# EAGLE design teletype-180824 (EAGLE 7.6.0)
COMPANY: monome

## Sheet 1 of 2
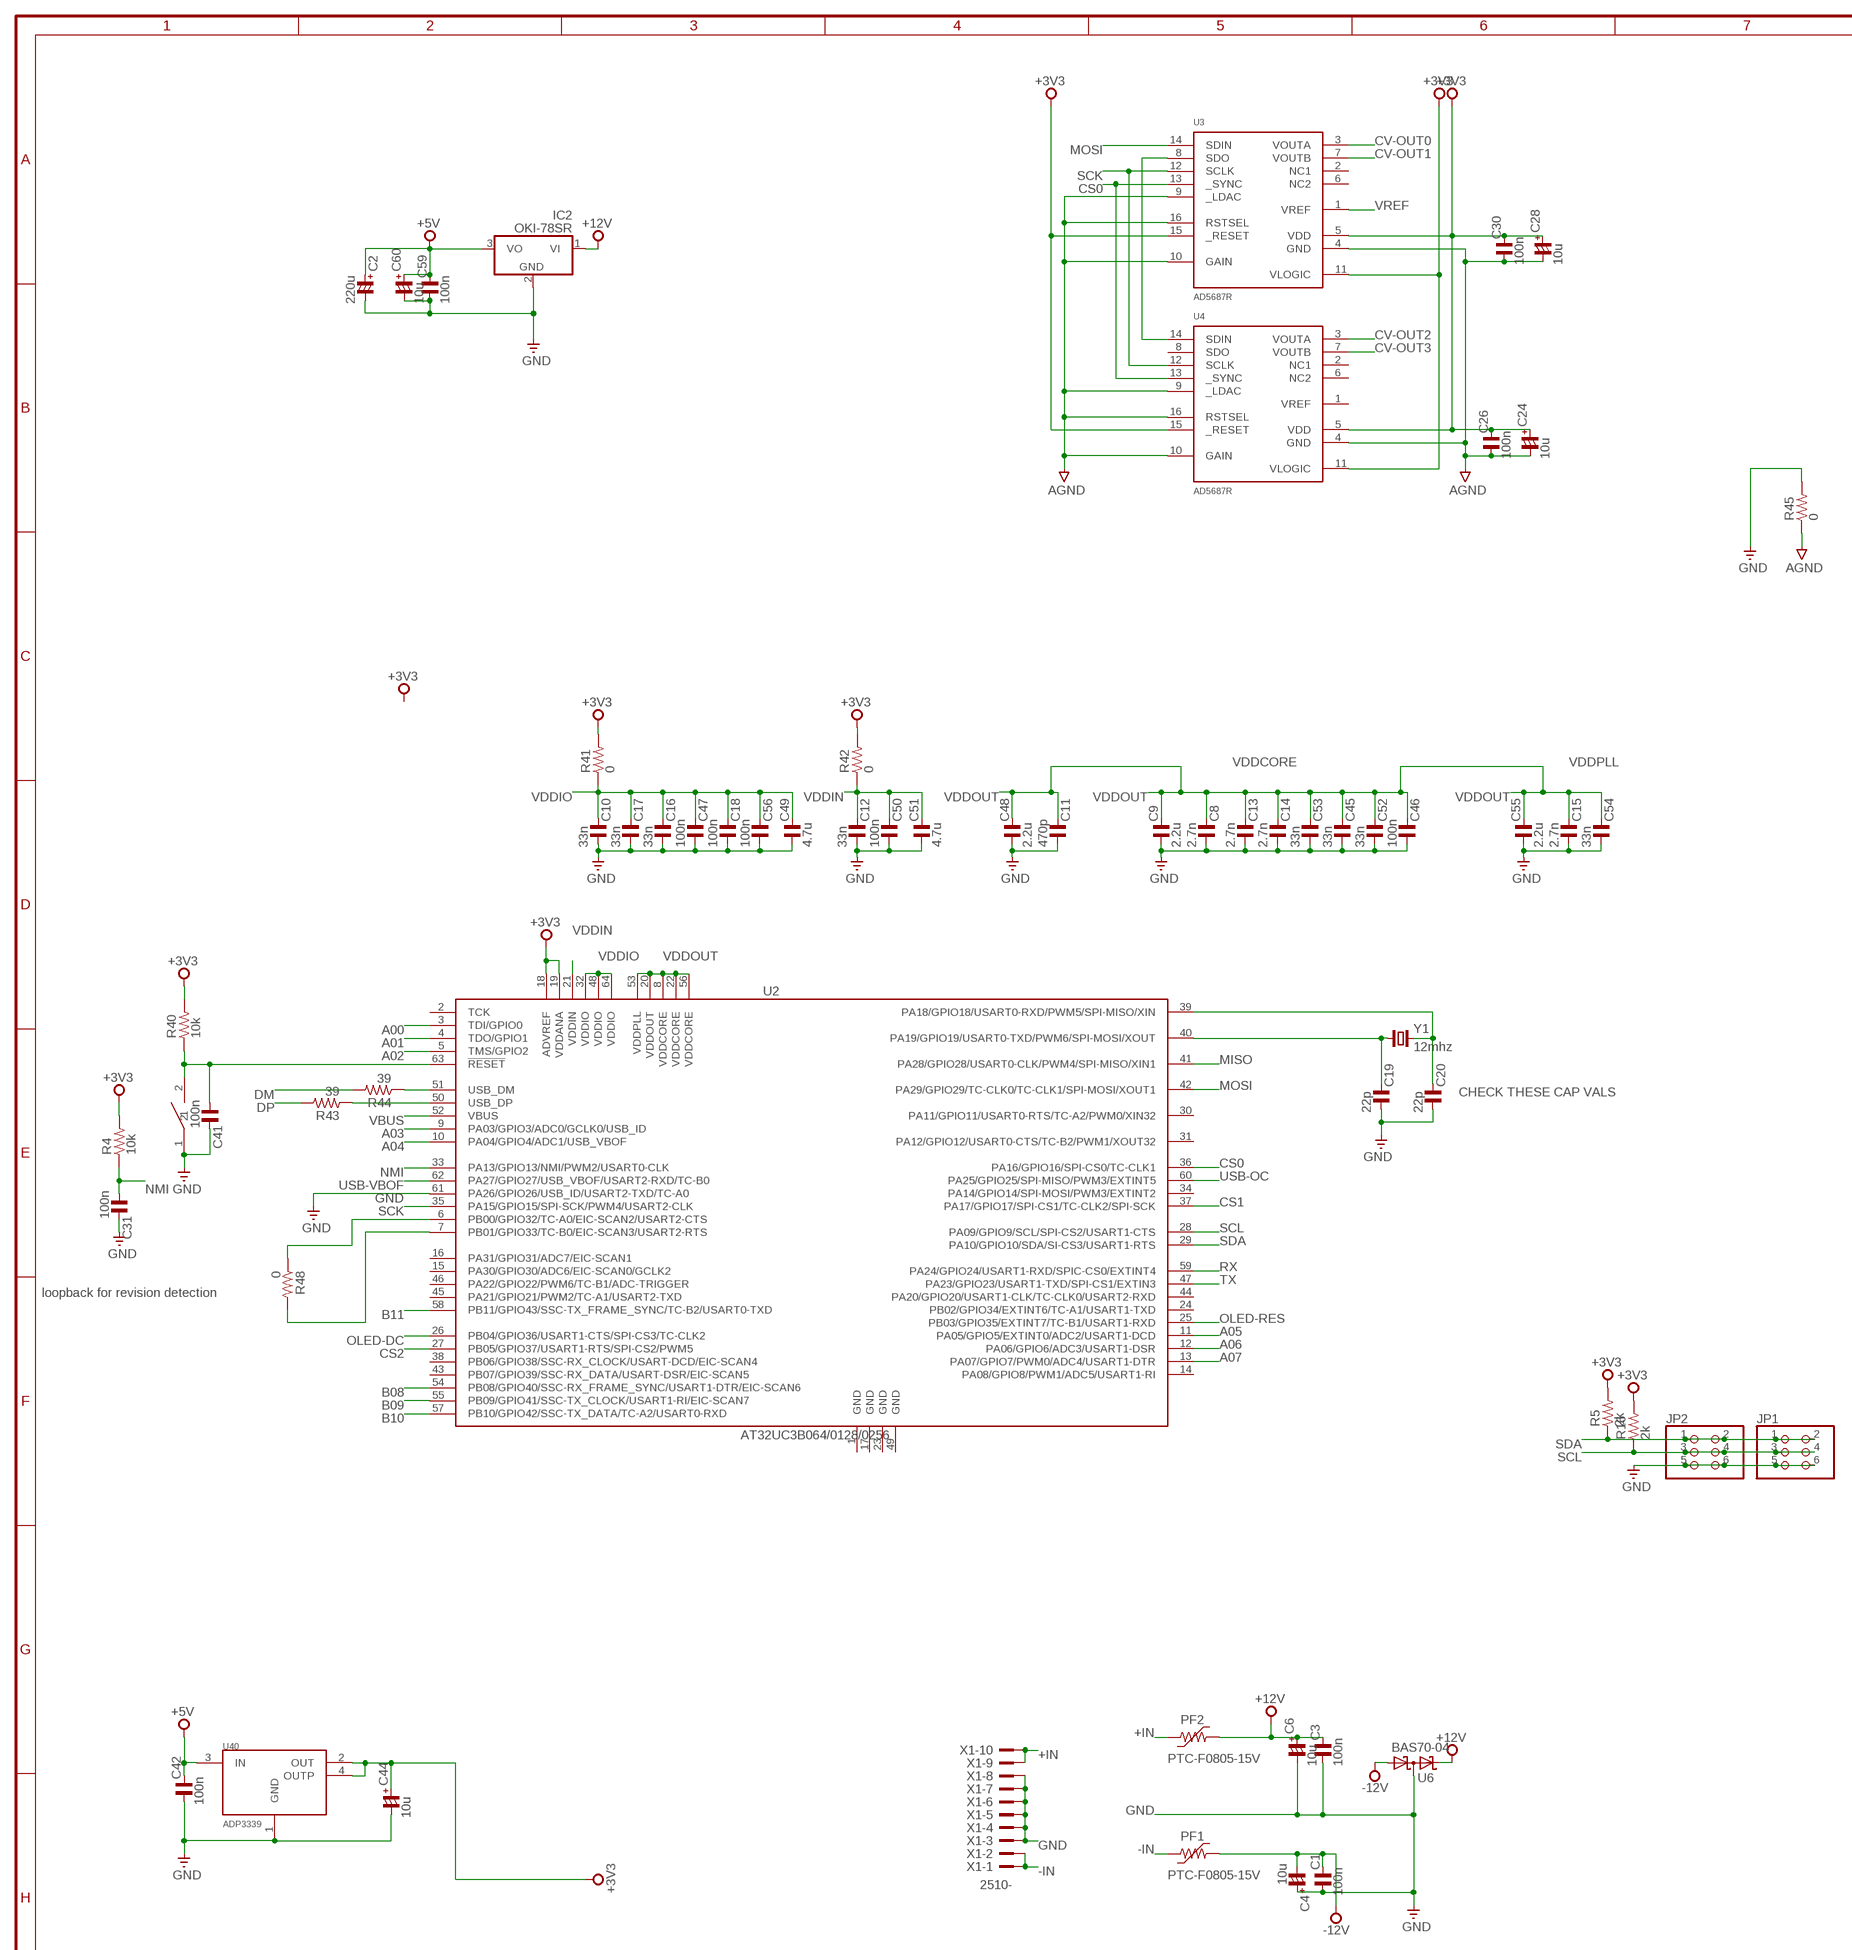
[diagram p0: schematic, sheet 1, part 1 of 2]
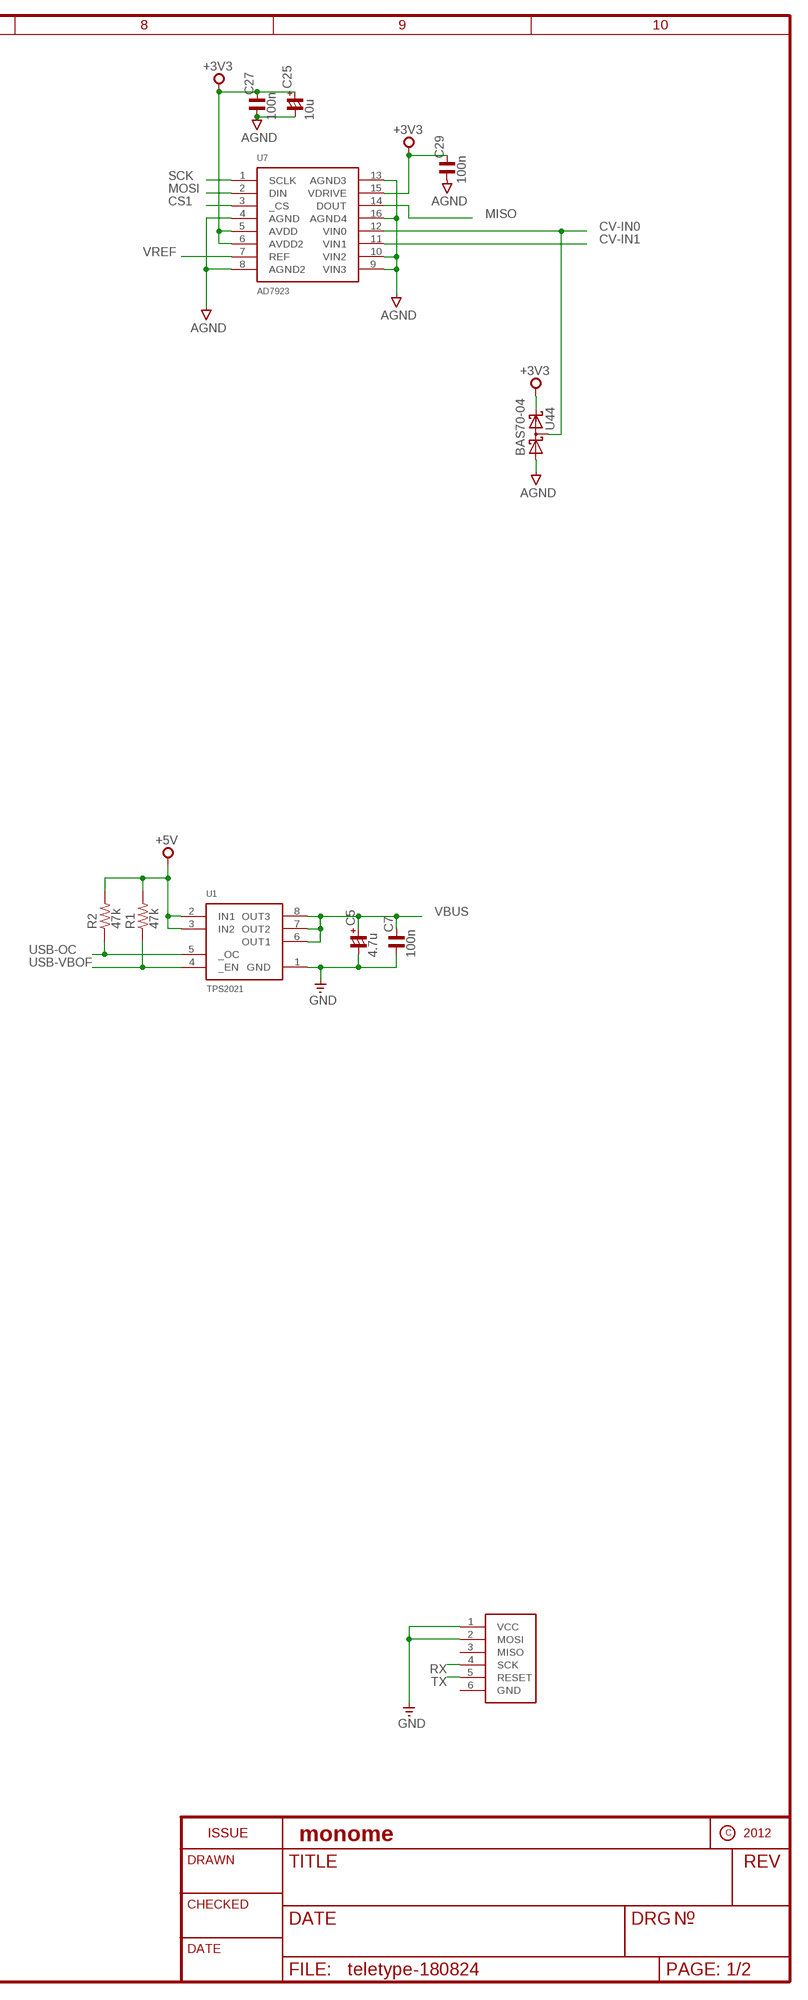
[diagram p1: schematic, sheet 1, part 2 of 2]

### Parts
C1  100n  C_0402  [C0402]
C2  220u  CP_7343-43  [C7343-43]
C3  100n  C_0402  [C0402]
C4  10u  CP_1206/T  [C1206/T]
C5  4.7u  CP_1206/T  [C1206/T]
C6  10u  CP_1206/T  [C1206/T]
C7  100n  C_0402  [C0402]
C8  2.7n  C_0402  [C0402]
C9  2.2u  C_0603  [C0603]
C10  33n  C_0402  [C0402]
C11  470p  C_0402  [C0402]
C12  33n  C_0402  [C0402]
C13  2.7n  C_0402  [C0402]
C14  2.7n  C_0402  [C0402]
C15  2.7n  C_0402  [C0402]
C16  33n  C_0402  [C0402]
C17  33n  C_0402  [C0402]
C18  100n  C_0402  [C0402]
C19  22p  C_0402  [C0402]
C20  22p  C_0402  [C0402]
C24  10u  CP_1206/T  [C1206/T]
C25  10u  CP_1206/T  [C1206/T]
C26  100n  C_0402  [C0402]
C27  100n  C_0402  [C0402]
C28  10u  CP_1206/T  [C1206/T]
C29  100n  C_0402  [C0402]
C30  100n  C_0402  [C0402]
C31  100n  C_0402  [C0402]
C41  100n  C_0402  [C0402]
C42  100n  C_0402  [C0402]
C44  10u  CP_1206/T  [C1206/T]
C45  33n  C_0402  [C0402]
C46  100n  C_0402  [C0402]
C47  100n  C_0402  [C0402]
C48  2.2u  C_0603  [C0603]
C49  4.7u  C_0603  [C0603]
C50  100n  C_0402  [C0402]
C51  4.7u  C_0603  [C0603]
C52  33n  C_0402  [C0402]
C53  33n  C_0402  [C0402]
C54  33n  C_0402  [C0402]
C55  2.2u  C_0603  [C0603]
C56  100n  C_0402  [C0402]
C59  100n  C_0402  [C0402]
C60  10u  CP_1206/T  [C1206/T]
IC2  OKI-78SR  7824TV  [TO220V]
J40  ISP-ROW  [ISP-ROW]
JP1  PINHD-2X3  [2X03]
JP2  PINHD-2X3  [2X03]
PF1  PTC-F0805-15V  PTC-F1206  [F1206]
PF2  PTC-F0805-15V  PTC-F1206  [F1206]
R1  47k  R_0402  [R0402]
R2  47k  R_0402  [R0402]
R4  10k  R_0402  [R0402]
R5  2k  R_0402  [R0402]
R16  2k  R_0402  [R0402]
R40  10k  R_0402  [R0402]
R41  0  R_0402  [R0402]
R42  0  R_0402  [R0402]
R43  39  R_0402  [R0402]
R44  39  R_0402  [R0402]
R45  0  R_0603  [R0603]
R48  0  R_0402  [R0402]
SW40  PANASONIC-EVQ  [PANASONIC-EVQ]
U1  TPS2021  TPS2020  [SO08]
U2  AT32UC3B064/0128/0256  [TQFP64-10X10]
U3  AD5687R  AD5689R  [TSSOP16]
U4  AD5687R  AD5689R  [TSSOP16]
U6  BAS70-04  [SOT23]
U7  AD7923  [TSSOP16]
U40  ADP3339  [SOT223]
U44  BAS70-04  [SOT23]
X1  2510-  [PAK100/2500-10]
Y1  12mhz  CRYTALHC49UP  [HC49UP]

### Nets
+3V3: C24.+ C25.+ C26.2 C27.2 C28.+ C29.2 C30.2 C44.+ R4.2 R5.2 R16.2 R40.2 R41.2 R42.2 U2.18(ADVREF) U2.19(VDDANA) U3.5(VDD) U3.11(VLOGIC) U3.15(_RESET) U4.5(VDD) U4.11(VLOGIC) U4.15(_RESET) U7.5(AVDD) U7.6(AVDD2) U7.15(VDRIVE) U40.2(OUT) U40.4(OUTP) U44.2(C2) ; also sheet 2
+5V: C2.+ C42.2 C59.2 C60.+ IC2.3(VO) R1.2 R2.2 U1.2(IN1) U1.3(IN2) U40.3(IN)
+12V: C3.2 C6.+ IC2.1(VI) PF2.2 U6.2(C2) ; also sheet 2
+IN: PF2.1 X1.9 X1.10
-12V: C1.2 C4.- PF1.2 U6.1(A1) ; also sheet 2
-IN: PF1.1 X1.1 X1.2
A00: U2.3(TDI/GPIO0) ; also sheet 2
A01: U2.4(TDO/GPIO1) ; also sheet 2
A02: U2.5(TMS/GPIO2) ; also sheet 2
A03: U2.9(PA03/GPIO3/ADC0/GCLK0/USB_ID) ; also sheet 2
A04: U2.10(PA04/GPIO4/ADC1/USB_VBOF) ; also sheet 2
A05: U2.11(PA05/GPIO5/EXTINT0/ADC2/USART1-DCD) ; also sheet 2
A06: U2.12(PA06/GPIO6/ADC3/USART1-DSR) ; also sheet 2
A07: U2.13(PA07/GPIO7/PWM0/ADC4/USART1-DTR) ; also sheet 2
AGND: C24.- C25.- C26.1 C27.1 C28.- C29.1 C30.1 R45.1 U3.4(GND) U3.9(_LDAC) U3.10(GAIN) U3.16(RSTSEL) U4.4(GND) U4.9(_LDAC) U4.10(GAIN) U4.16(RSTSEL) U7.4(AGND) U7.8(AGND2) U7.9(VIN3) U7.10(VIN2) U7.13(AGND3) U7.16(AGND4) U44.1(A1) ; also sheet 2
B08: U2.54(PB08/GPIO40/SSC-RX_FRAME_SYNC/USART1-DTR/EIC-SCAN6) ; also sheet 2
B09: U2.55(PB09/GPIO41/SSC-TX_CLOCK/USART1-RI/EIC-SCAN7) ; also sheet 2
B10: U2.57(PB10/GPIO42/SSC-TX_DATA/TC-A2/USART0-RXD) ; also sheet 2
B11: U2.58(PB11/GPIO43/SSC-TX_FRAME_SYNC/TC-B2/USART0-TXD) ; also sheet 2
CS0: U2.36(PA16/GPIO16/SPI-CS0/TC-CLK1) U3.13(_SYNC) U4.13(_SYNC)
CS1: U2.37(PA17/GPIO17/SPI-CS1/TC-CLK2/SPI-SCK) U7.3(_CS)
CS2: U2.27(PB05/GPIO37/USART1-RTS/SPI-CS2/PWM5) ; also sheet 2
CV-IN0: U7.12(VIN0) U44.3(C1A2) ; also sheet 2
CV-IN1: U7.11(VIN1) ; also sheet 2
CV-OUT0: U3.3(VOUTA) ; also sheet 2
CV-OUT1: U3.7(VOUTB) ; also sheet 2
CV-OUT2: U4.3(VOUTA) ; also sheet 2
CV-OUT3: U4.7(VOUTB) ; also sheet 2
DM: R44.2 ; also sheet 2
DP: R43.2 ; also sheet 2
GND: C1.1 C2.- C3.1 C4.+ C5.- C6.- C7.1 C8.1 C9.1 C10.1 C11.1 C12.1 C13.1 C14.1 C15.1 C16.1 C17.1 C18.1 C19.1 C20.1 C31.2 C41.2 C42.1 C44.- C45.1 C46.1 C47.1 C48.1 C49.1 C50.1 C51.1 C52.1 C53.1 C54.1 C55.1 C56.1 C59.1 C60.- IC2.2(GND) J40.1(VCC) J40.2(MOSI) JP1.5 JP1.6 JP2.5 JP2.6 R45.2 SW40.1 U1.1(GND) U2.61(PA26/GPIO26/USB_ID/USART2-TXD/TC-A0) U6.3(C1A2) U40.1(GND) X1.3 X1.4 X1.5 X1.6 X1.7 X1.8 ; also sheet 2
MISO: U2.41(PA28/GPIO28/USART0-CLK/PWM4/SPI-MISO/XIN1) U7.14(DOUT)
MOSI: U2.42(PA29/GPIO29/TC-CLK0/TC-CLK1/SPI-MOSI/XOUT1) U3.14(SDIN) U7.2(DIN) ; also sheet 2
N$1: R44.1 U2.51(USB_DM)
N$2: R43.1 U2.50(USB_DP)
N$4: U3.8(SDO) U4.14(SDIN)
N$14: C20.2 U2.39(PA18/GPIO18/USART0-RXD/PWM5/SPI-MISO/XIN) Y1.2
N$17: R48.1 U2.6(PB00/GPIO32/TC-A0/EIC-SCAN2/USART2-CTS)
N$18: R48.2 U2.7(PB01/GPIO33/TC-B0/EIC-SCAN3/USART2-RTS)
N$109: C19.2 U2.40(PA19/GPIO19/USART0-TXD/PWM6/SPI-MOSI/XOUT) Y1.1
NMI: C31.1 R4.1 U2.33(PA13/GPIO13/NMI/PWM2/USART0-CLK) ; also sheet 2
OLED-DC: U2.26(PB04/GPIO36/USART1-CTS/SPI-CS3/TC-CLK2) ; also sheet 2
OLED-RES: U2.25(PB03/GPIO35/EXTINT7/TC-B1/USART1-RXD) ; also sheet 2
RESET: C41.1 R40.1 SW40.2 U2.63(!RESET)
RX: J40.4(SCK) U2.59(PA24/GPIO24/USART1-RXD/SPIC-CS0/EXTINT4)
SCK: U2.35(PA15/GPIO15/SPI-SCK/PWM4/USART2-CLK) U3.12(SCLK) U4.12(SCLK) U7.1(SCLK) ; also sheet 2
SCL: JP1.3 JP1.4 JP2.3 JP2.4 R16.1 U2.28(PA09/GPIO9/SCL/SPI-CS2/USART1-CTS)
SDA: JP1.1 JP1.2 JP2.1 JP2.2 R5.1 U2.29(PA10/GPIO10/SDA/SI-CS3/USART1-RTS)
TX: J40.5(RESET) U2.47(PA23/GPIO23/USART1-TXD/SPI-CS1/EXTIN3)
USB-OC: R2.1 U1.5(_OC) U2.60(PA25/GPIO25/SPI-MISO/PWM3/EXTINT5)
USB-VBOF: R1.1 U1.4(_EN) U2.62(PA27/GPIO27/USB_VBOF/USART2-RXD/TC-B0)
VBUS: C5.+ C7.2 U1.6(OUT1) U1.7(OUT2) U1.8(OUT3) U2.52(VBUS) ; also sheet 2
VDDIN: C12.2 C50.2 C51.2 R42.1 U2.21(VDDIN)
VDDIO: C10.2 C16.2 C17.2 C18.2 C47.2 C49.2 C56.2 R41.1 U2.32(VDDIO) U2.48(VDDIO) U2.64(VDDIO)
VDDOUT: C8.2 C9.2 C11.2 C13.2 C14.2 C15.2 C45.2 C46.2 C48.2 C52.2 C53.2 C54.2 C55.2 U2.8(VDDCORE) U2.20(VDDOUT) U2.22(VDDCORE) U2.53(VDDPLL) U2.56(VDDCORE)
VREF: U3.1(VREF) U7.7(REF)
Unconnected: J40.3(MISO) J40.6(GND) U2.2(TCK) U2.14(PA08/GPIO8/PWM1/ADC5/USART1-RI) U2.15(PA30/GPIO30/ADC6/EIC-SCAN0/GCLK2) U2.16(PA31/GPIO31/ADC7/EIC-SCAN1) U2.24(PB02/GPIO34/EXTINT6/TC-A1/USART1-TXD) U2.30(PA11/GPIO11/USART0-RTS/TC-A2/PWM0/XIN32) U2.31(PA12/GPIO12/USART0-CTS/TC-B2/PWM1/XOUT32) U2.34(PA14/GPIO14/SPI-MOSI/PWM3/EXTINT2) U2.38(PB06/GPIO38/SSC-RX_CLOCK/USART-DCD/EIC-SCAN4) U2.43(PB07/GPIO39/SSC-RX_DATA/USART-DSR/EIC-SCAN5) U2.44(PA20/GPIO20/USART1-CLK/TC-CLK0/USART2-RXD) U2.45(PA21/GPIO21/PWM2/TC-A1/USART2-TXD) U2.46(PA22/GPIO22/PWM6/TC-B1/ADC-TRIGGER) U3.2(NC1) U3.6(NC2) U4.1(VREF) U4.2(NC1) U4.6(NC2) U4.8(SDO)

### Notes on the sheet
- VDDCORE | VDDPLL
- CHECK THESE CAP VALS
- loopback for revision detection

## Sheet 2 of 2
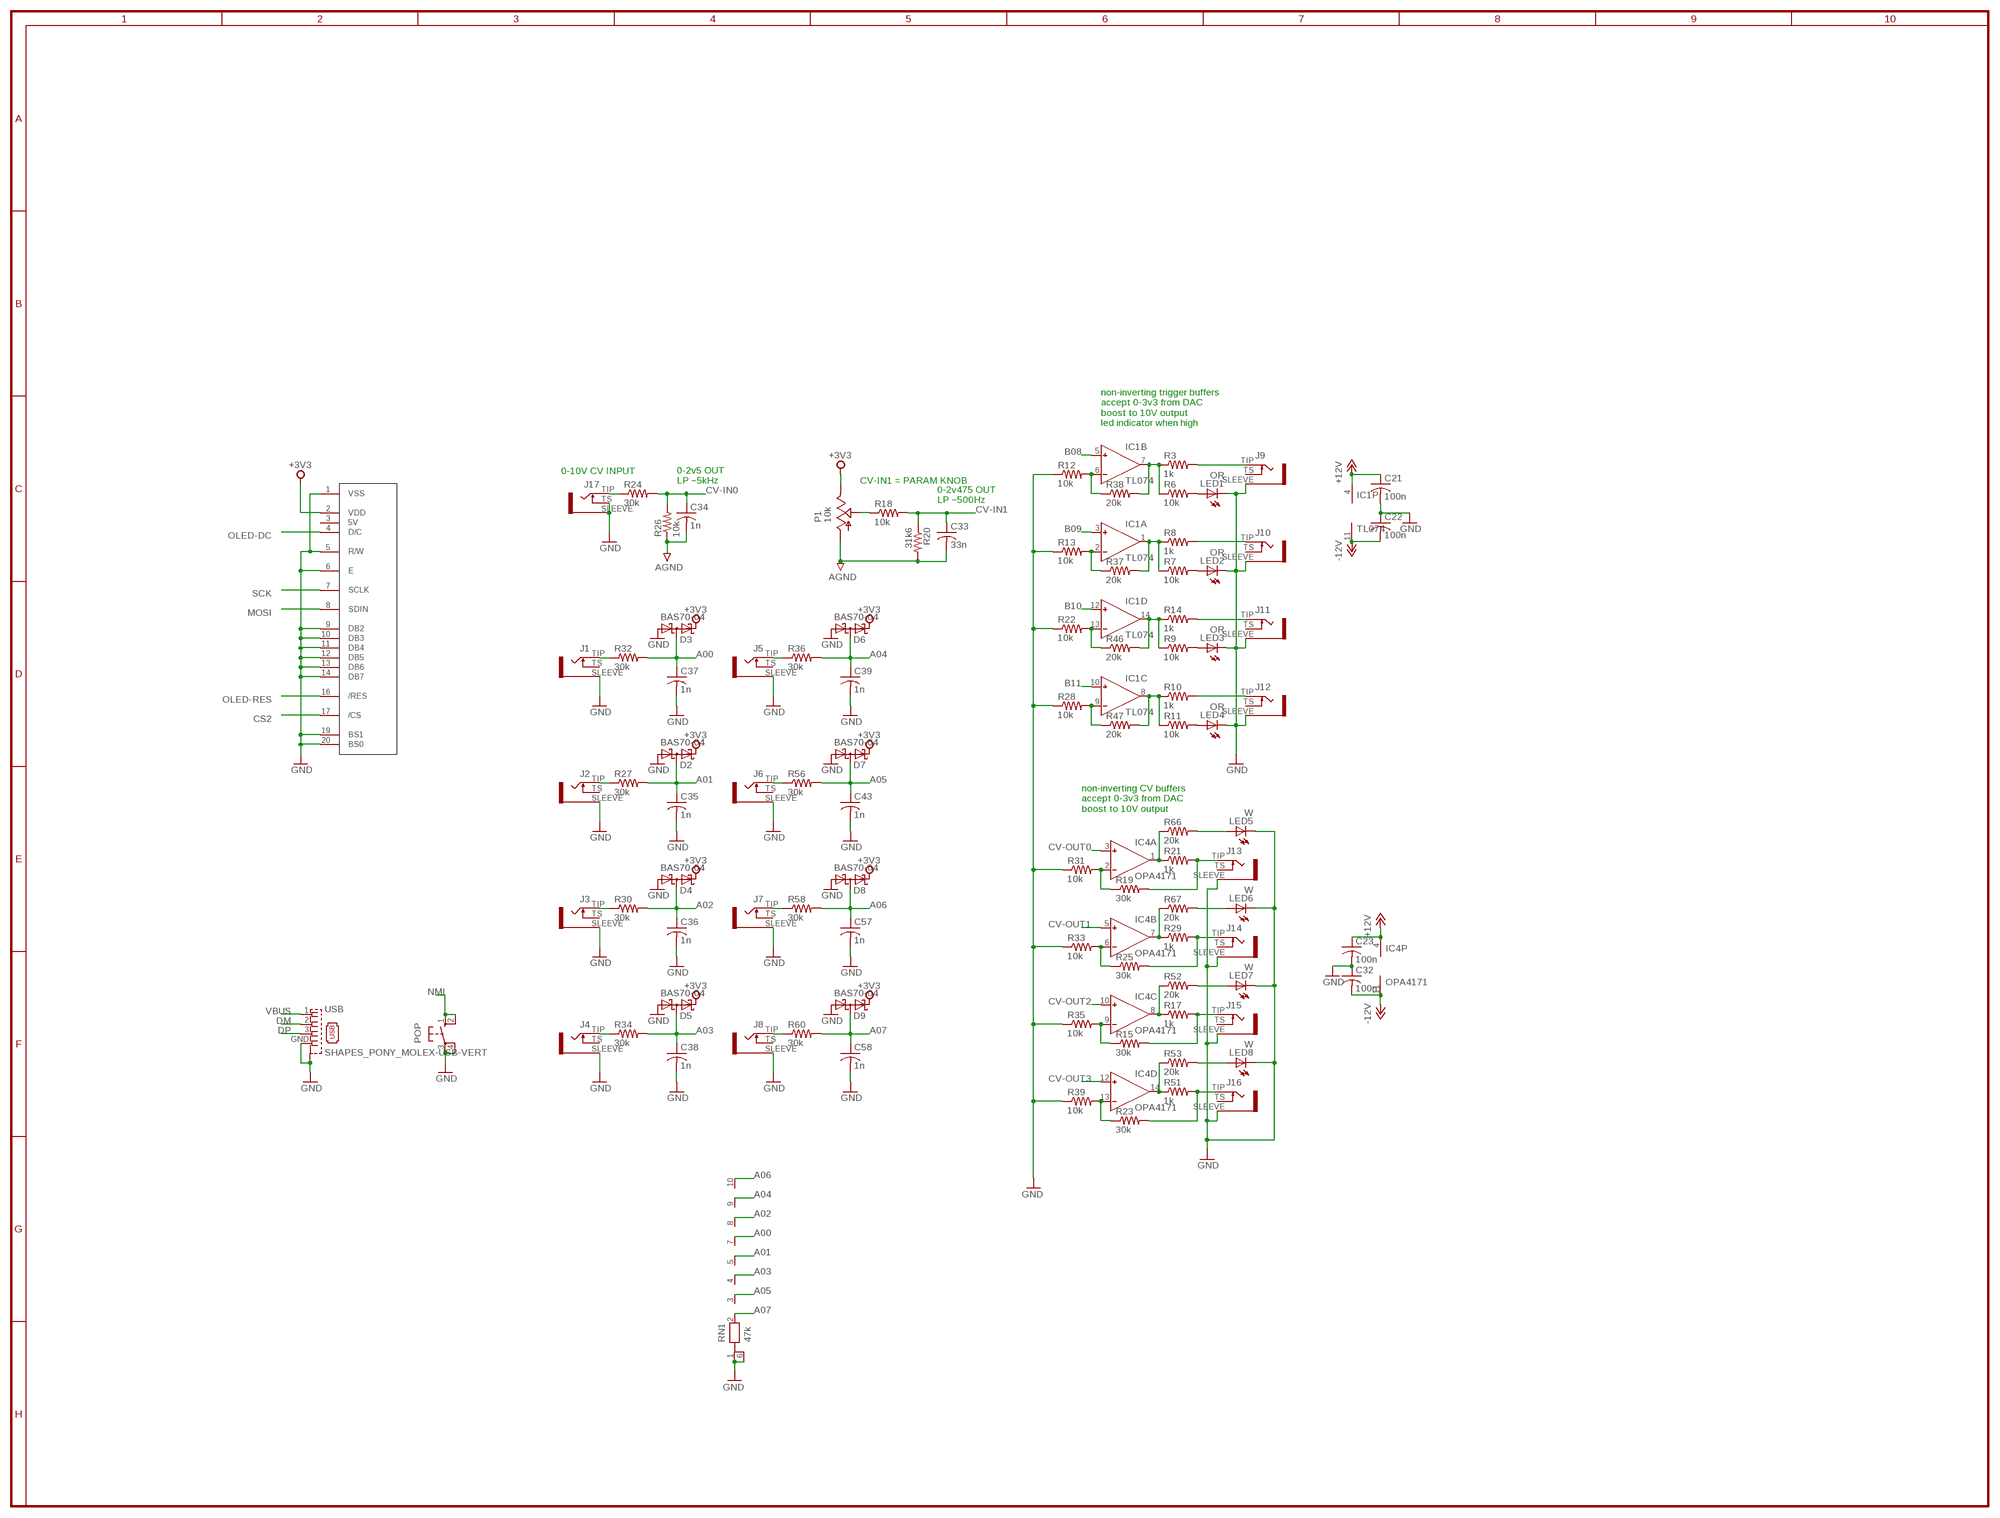
[diagram p2: schematic, sheet 2]

### Parts
C21  100n  C-USC0402  [C0402]
C22  100n  C-USC0402  [C0402]
C23  100n  C-USC0402  [C0402]
C32  100n  C-USC0402  [C0402]
C33  33n  C-USC0402  [C0402]
C34  1n  C-USC0402  [C0402]
C35  1n  C-USC0402  [C0402]
C36  1n  C-USC0402  [C0402]
C37  1n  C-USC0402  [C0402]
C38  1n  C-USC0402  [C0402]
C39  1n  C-USC0402  [C0402]
C43  1n  C-USC0402  [C0402]
C57  1n  C-USC0402  [C0402]
C58  1n  C-USC0402  [C0402]
D2  BAS70-04  [SOT23]
D3  BAS70-04  [SOT23]
D4  BAS70-04  [SOT23]
D5  BAS70-04  [SOT23]
D6  BAS70-04  [SOT23]
D7  BAS70-04  [SOT23]
D8  BAS70-04  [SOT23]
D9  BAS70-04  [SOT23]
IC1  TL074  AD8644R  [SO14]
IC4  OPA4171  AD8644R  [SO14]
J1  WQP-PJ301M-12_JACK  [WQP-PJ301M-12_JACK]
J2  WQP-PJ301M-12_JACK  [WQP-PJ301M-12_JACK]
J3  WQP-PJ301M-12_JACK  [WQP-PJ301M-12_JACK]
J4  WQP-PJ301M-12_JACK  [WQP-PJ301M-12_JACK]
J5  WQP-PJ301M-12_JACK  [WQP-PJ301M-12_JACK]
J6  WQP-PJ301M-12_JACK  [WQP-PJ301M-12_JACK]
J7  WQP-PJ301M-12_JACK  [WQP-PJ301M-12_JACK]
J8  WQP-PJ301M-12_JACK  [WQP-PJ301M-12_JACK]
J9  WQP-PJ301M-12_JACK  [WQP-PJ301M-12_JACK]
J10  WQP-PJ301M-12_JACK  [WQP-PJ301M-12_JACK]
J11  WQP-PJ301M-12_JACK  [WQP-PJ301M-12_JACK]
J12  WQP-PJ301M-12_JACK  [WQP-PJ301M-12_JACK]
J13  WQP-PJ301M-12_JACK  [WQP-PJ301M-12_JACK]
J14  WQP-PJ301M-12_JACK  [WQP-PJ301M-12_JACK]
J15  WQP-PJ301M-12_JACK  [WQP-PJ301M-12_JACK]
J16  WQP-PJ301M-12_JACK  [WQP-PJ301M-12_JACK]
J17  WQP-PJ301M-12_JACK  [WQP-PJ301M-12_JACK]
LED1  OR  LEDCHIP-LED0805  [CHIP-LED0805]
LED2  OR  LEDCHIP-LED0805  [CHIP-LED0805]
LED3  OR  LEDCHIP-LED0805  [CHIP-LED0805]
LED4  OR  LEDCHIP-LED0805  [CHIP-LED0805]
LED5  W  LEDCHIP-LED0805  [CHIP-LED0805]
LED6  W  LEDCHIP-LED0805  [CHIP-LED0805]
LED7  W  LEDCHIP-LED0805  [CHIP-LED0805]
LED8  W  LEDCHIP-LED0805  [CHIP-LED0805]
P1  10k  SHAPES_POT-ALPS_POT_USVERTICAL_PS  [SHAPES_POT-ALPS_ALPS_POT_VERTICAL_PS]
POP  SWITCH-OMRON_10-XX  [SWITCH-OMRON_B3F-10XX]
R3  1k  R-US_R0402  [R0402]
R6  10k  R-US_R0402  [R0402]
R7  10k  R-US_R0402  [R0402]
R8  1k  R-US_R0402  [R0402]
R9  10k  R-US_R0402  [R0402]
R10  1k  R-US_R0402  [R0402]
R11  10k  R-US_R0402  [R0402]
R12  10k  R-US_R0402  [R0402]
R13  10k  R-US_R0402  [R0402]
R14  1k  R-US_R0402  [R0402]
R15  30k  R-US_R0402  [R0402]
R17  1k  R-US_R0402  [R0402]
R18  10k  R-US_R0402  [R0402]
R19  30k  R-US_R0402  [R0402]
R20  31k6  R-US_R0402  [R0402]
R21  1k  R-US_R0402  [R0402]
R22  10k  R-US_R0402  [R0402]
R23  30k  R-US_R0402  [R0402]
R24  30k  R-US_R0402  [R0402]
R25  30k  R-US_R0402  [R0402]
R26  10k  R-US_R0402  [R0402]
R27  30k  R-US_R0402  [R0402]
R28  10k  R-US_R0402  [R0402]
R29  1k  R-US_R0402  [R0402]
R30  30k  R-US_R0402  [R0402]
R31  10k  R-US_R0402  [R0402]
R32  30k  R-US_R0402  [R0402]
R33  10k  R-US_R0402  [R0402]
R34  30k  R-US_R0402  [R0402]
R35  10k  R-US_R0402  [R0402]
R36  30k  R-US_R0402  [R0402]
R37  20k  R-US_R0402  [R0402]
R38  20k  R-US_R0402  [R0402]
R39  10k  R-US_R0402  [R0402]
R46  20k  R-US_R0402  [R0402]
R47  20k  R-US_R0402  [R0402]
R51  1k  R-US_R0402  [R0402]
R52  20k  R-US_R0402  [R0402]
R53  20k  R-US_R0402  [R0402]
R56  30k  R-US_R0402  [R0402]
R58  30k  R-US_R0402  [R0402]
R60  30k  R-US_R0402  [R0402]
R66  20k  R-US_R0402  [R0402]
R67  20k  R-US_R0402  [R0402]
RN1  47k  RESNET08  [MNR35]
U$1  OLED128X64  [OLED-ALEPH]
USB  SHAPES_PONY_MOLEX-USB-VERT  [SHAPES_PONY_MOLEX-USB]

### Nets
+3V3: D2.2(C2) D3.2(C2) D4.2(C2) D5.2(C2) D6.2(C2) D7.2(C2) D8.2(C2) D9.2(C2) P1.P$1(E) U$1.2(VDD) ; also sheet 1
+12V: C21.1 C23.1 IC1.4(P:V+) IC4.4(P:V+) ; also sheet 1
-12V: C22.2 C32.2 IC1.11(P:V-) IC4.11(P:V-) ; also sheet 1
A00: C37.1 D3.3(C1A2) R32.2 RN1.7 ; also sheet 1
A01: C35.1 D2.3(C1A2) R27.2 RN1.5 ; also sheet 1
A02: C36.1 D4.3(C1A2) R30.2 RN1.8 ; also sheet 1
A03: C38.1 D5.3(C1A2) R34.2 RN1.4 ; also sheet 1
A04: C39.1 D6.3(C1A2) R36.2 RN1.9 ; also sheet 1
A05: C43.1 D7.3(C1A2) R56.2 RN1.3 ; also sheet 1
A06: C57.1 D8.3(C1A2) R58.2 RN1.10 ; also sheet 1
A07: C58.1 D9.3(C1A2) R60.2 RN1.2 ; also sheet 1
AGND: C33.2 C34.2 P1.P$3(A) R20.2 R26.1 ; also sheet 1
B08: IC1.5(B:IN+) ; also sheet 1
B09: IC1.3(A:IN+) ; also sheet 1
B10: IC1.12(D:IN+) ; also sheet 1
B11: IC1.10(C:IN+) ; also sheet 1
CS2: U$1.17(/CS) ; also sheet 1
CV-IN0: C34.1 R24.2 R26.2 ; also sheet 1
CV-IN1: C33.1 R18.2 R20.1 ; also sheet 1
CV-OUT0: IC4.3(A:IN+) ; also sheet 1
CV-OUT1: IC4.5(B:IN+) ; also sheet 1
CV-OUT2: IC4.10(C:IN+) ; also sheet 1
CV-OUT3: IC4.12(D:IN+) ; also sheet 1
DM: USB.2 ; also sheet 1
DP: USB.3 ; also sheet 1
GND: C21.2 C22.1 C23.2 C32.1 C35.2 C36.2 C37.2 C38.2 C39.2 C43.2 C57.2 C58.2 D2.1(A1) D3.1(A1) D4.1(A1) D5.1(A1) D6.1(A1) D7.1(A1) D8.1(A1) D9.1(A1) J1.SLEEVE J2.SLEEVE J3.SLEEVE J4.SLEEVE J5.SLEEVE J6.SLEEVE J7.SLEEVE J8.SLEEVE J9.SLEEVE J10.SLEEVE J11.SLEEVE J12.SLEEVE J13.SLEEVE J14.SLEEVE J15.SLEEVE J16.SLEEVE J17.SLEEVE J17.TS LED1.C LED2.C LED3.C LED4.C LED5.C LED6.C LED7.C LED8.C POP.3(P) POP.4(P1) R12.1 R13.1 R22.1 R28.1 R31.1 R33.1 R35.1 R39.1 RN1.1 RN1.6 U$1.1(VSS) U$1.5(R/W) U$1.6(E) U$1.9(DB2) U$1.10(DB3) U$1.11(DB4) U$1.12(DB5) U$1.13(DB6) U$1.14(DB7) U$1.19(BS1) U$1.20(BS0) USB.GND USB.M1(S1) USB.M2(S1) USB.M4(S1) ; also sheet 1
MOSI: U$1.8(SDIN) ; also sheet 1
N$3: IC1.7(B:OUT) R3.1 R6.1 R38.2
N$5: IC1.1(A:OUT) R7.1 R8.1 R37.2
N$6: IC1.14(D:OUT) R9.1 R14.1 R46.2
N$7: IC1.8(C:OUT) R10.1 R11.1 R47.2
N$8: J9.TIP R3.2
N$9: J10.TIP R8.2
N$10: J11.TIP R14.2
N$11: J12.TIP R10.2
N$12: P1.P$2(S) R18.1
N$13: IC4.1(A:OUT) R21.1 R66.1
N$15: IC4.7(B:OUT) R29.1 R67.1
N$16: LED5.A R66.2
N$21: J15.TIP R15.2 R17.2
N$22: J16.TIP R23.2 R51.2
N$23: IC4.8(C:OUT) R17.1 R52.1
N$24: LED6.A R67.2
N$28: IC4.14(D:OUT) R51.1 R53.1
N$29: LED7.A R52.2
N$30: LED8.A R53.2
N$32: J13.TIP R19.2 R21.2
N$33: J17.TIP R24.1
N$34: J14.TIP R25.2 R29.2
N$35: J2.TIP R27.1
N$36: J3.TIP R30.1
N$37: J4.TIP R34.1
N$38: J1.TIP R32.1
N$39: J5.TIP R36.1
N$40: J6.TIP R56.1
N$43: J7.TIP R58.1
N$44: J8.TIP R60.1
N$67: LED1.A R6.2
N$68: LED2.A R7.2
N$70: LED3.A R9.2
N$71: LED4.A R11.2
NMI: POP.1(S) POP.2(S1) ; also sheet 1
OLED-DC: U$1.4(D/C) ; also sheet 1
OLED-RES: U$1.16(/RES) ; also sheet 1
RG1: IC1.6(B:IN-) R12.2 R38.1
RG2: IC1.2(A:IN-) R13.2 R37.1
RG3: IC1.13(D:IN-) R22.2 R46.1
RG4: IC1.9(C:IN-) R28.2 R47.1
RG5: IC4.2(A:IN-) R19.1 R31.2
RG6: IC4.6(B:IN-) R25.1 R33.2
RG7: IC4.9(C:IN-) R15.1 R35.2
RG8: IC4.13(D:IN-) R23.1 R39.2
SCK: U$1.7(SCLK) ; also sheet 1
VBUS: USB.1 ; also sheet 1
Unconnected: J1.TS J2.TS J3.TS J4.TS J5.TS J6.TS J7.TS J8.TS J9.TS J10.TS J11.TS J12.TS J13.TS J14.TS J15.TS J16.TS U$1.3(5V)

### Notes on the sheet
- non-inverting trigger buffers
  accept 0-3v3 from DAC
  boost to 10V output
  led indicator when high
- 0-10V CV INPUT
- 0-2v5 OUT
  LP ~5kHz
- CV-IN1 = PARAM KNOB
- 0-2v475 OUT
  LP ~500Hz
- non-inverting CV buffers
  accept 0-3v3 from DAC
  boost to 10V output

## Power pins joined to a net without a drawn wire
GND: U2.1(GND) U2.17(GND) U2.23(GND) U2.49(GND)

## Library data of the parts
C1 C3 C7-C20 C26 C27 C29-C31 C41 C42 C45-C56 C59 = rc-master-smd:C_: NON-POLARIZED CAP
C2 C4-C6 C24 C25 C28 C44 C60 = rc-master-smd:CP_: POLARIZED CAP
C21-C23 C32-C39 C43 C57 C58 = rcl:C-US: CAPACITOR, American symbol
D2-D9 U6 U44 = diode:BAS70-04: Silicon Schottky Diodes General-purpose diode for high-speed switching
IC1 IC4 = analog-devices:AD8644: Single and Quad 18 V Operational Amplifiers Source: http://www.analog.com/static/imported-files/data_sheets/AD8614_8644.pdf; MF: ALTERA CORPORATION; MPN: AD8644ARZ; OC_FARNELL: 1438873; OC_NEWARK: 59K7037
IC2 = linear:78*: Positive VOLTAGE REGULATOR Source: http://cache.national.com/ds/LM/LM78L05.pdf http://www.fairchildsemi.com/ds/LM/LM7805.pdf
J1-J17 = thonkiconn:WQP-PJ301M-12_JACK
J40 = monome-inc:ISP-ROW
JP1 JP2 = pinhead:PINHD-2X3: PIN HEADER
LED1-LED8 = led:LED: LED OSRAM: - CHIPLED LG R971, LG N971, LY N971, LG Q971, LY Q971, LO R971, LY R971 LH N974, LH R974 LS Q976, LO Q976, LY Q976 LO Q996 - Hyper CHIPLED LW Q18S LB Q993, LB Q99A, LB R99A - SideLED LS A670, LO A670, LY A670, LG A670, LP A670 LB A673, LV A673, LT A673, LW A673 LH A674 LY A675 LS A676, LA A676, LO A676, LY A676, LW A676 LS A679, LY A679, LG A679 - Hyper Micro SIDELED® LS Y876, LA Y876, LO Y876, LY Y876 LT Y87S - SmartLED LW L88C, LW L88S LB L89C, LB L89S, LG L890 LS L89K, LO L89K, LY L89K LS L896, LA L896, LO L896, LY L896 - TOPLED LS T670, LO T670, LY T670, LG T670, LP T670 LSG T670, LSP T670, LSY T670, LOP T670, LYG T670 LG T671, LOG T671, LSG T671 LB T673, LV T673, LT T673, LW T673 LH T674 LS T676, LA T676, LO T676, LY T676, LB T676, LH T676, LSB T676, LW T676 LB T67C, LV T67C, LT T67C, LS T67K, LO T67K, LY T67K, LW E67C LS E67B, LA E67B, LO E67B, LY E67B, LB E67C, LV E67C, LT E67C LW T67C LS T679, LY T679, LG T679 LS T770, LO T770, LY T770, LG T770, LP T770 LB T773, LV T773, LT T773, LW T773 LH T774 LS E675, LA E675, LY E675, LS T675 LS T776, LA T776, LO T776, LY T776, LB T776 LHGB T686 LT T68C, LB T68C - Hyper Mini TOPLED® LB M676 - Mini TOPLED Santana® LG M470 LS M47K, LO M47K, LY M47K Source: http://www.osram.convergy.de LUXEON: - LUMILED® LXK2-PW12-R00, LXK2-PW12-S00, LXK2-PW14-U00, LXK2-PW14-V00 LXK2-PM12-R00, LXK2-PM12-S00, LXK2-PM14-U00 LXK2-PE12-Q00, LXK2-PE12-R00, LXK2-PE12-S00, LXK2-PE14-T00, LXK2-PE14-U00 LXK2-PB12-K00, LXK2-PB12-L00, LXK2-PB12-M00, LXK2-PB14-N00, LXK2-PB14-P00, LXK2-PB14-Q00 LXK2-PR12-L00, LXK2-PR12-M00, LXK2-PR14-Q00, LXK2-PR14-R00 LXK2-PD12-Q00, LXK2-PD12-R00, LXK2-PD12-S00 LXK2-PH12-R00, LXK2-PH12-S00 LXK2-PL12-P00, LXK2-PL12-Q00, LXK2-PL12-R00 Source: www.luxeon.com KINGBRIGHT: KA-3528ASYC Source: www.kingbright.com
P1 = monome_modular:SHAPES_POT-ALPS_POT_US
PF1 PF2 = polyswitch:PTC-: POLYSWITCH Polyswitch Resetable Fuses
POP = monome_modular:SWITCH-OMRON_10-XX: OMRON SWITCH; MPN: B3F-1000; OC_FARNELL: 176432; OC_NEWARK: 36M3542
R1 R2 R4 R5 R16 R40-R45 R48 = rc-master-smd:R_: RESISTOR
R3 R6-R15 R17-R39 R46 R47 R51-R53 R56 R58 R60 R66 R67 = rcl:R-US_: RESISTOR, American symbol
RN1 = field:RESNET08
SW40 = monome-inc:PANASONIC-EVQ
U1 = monome-inc:TPS2020
U2 = atmel-avr32-michel-rev1:AT32UC3B064/0128/0256: AT32UC3B0128/0256/0512
U3 U4 = monome-inc:AD5689R
U7 = monome-inc:AD7923: ADC quad 12 bit
U40 = monome-inc:ADP3339
U$1 = monome_modular:OLED128X64
USB = monome_modular:SHAPES_PONY_MOLEX-USB-VERT
X1 = con-3m:2510-: 3M (TM) Pak 100 4-Wall Header Source: 3M; MF: 3M; MPN: 2510-6002UB; OC_FARNELL: 9838244; OC_NEWARK: 46F4725
Y1 = crystal:CRYTAL: CRYSTAL

## Board
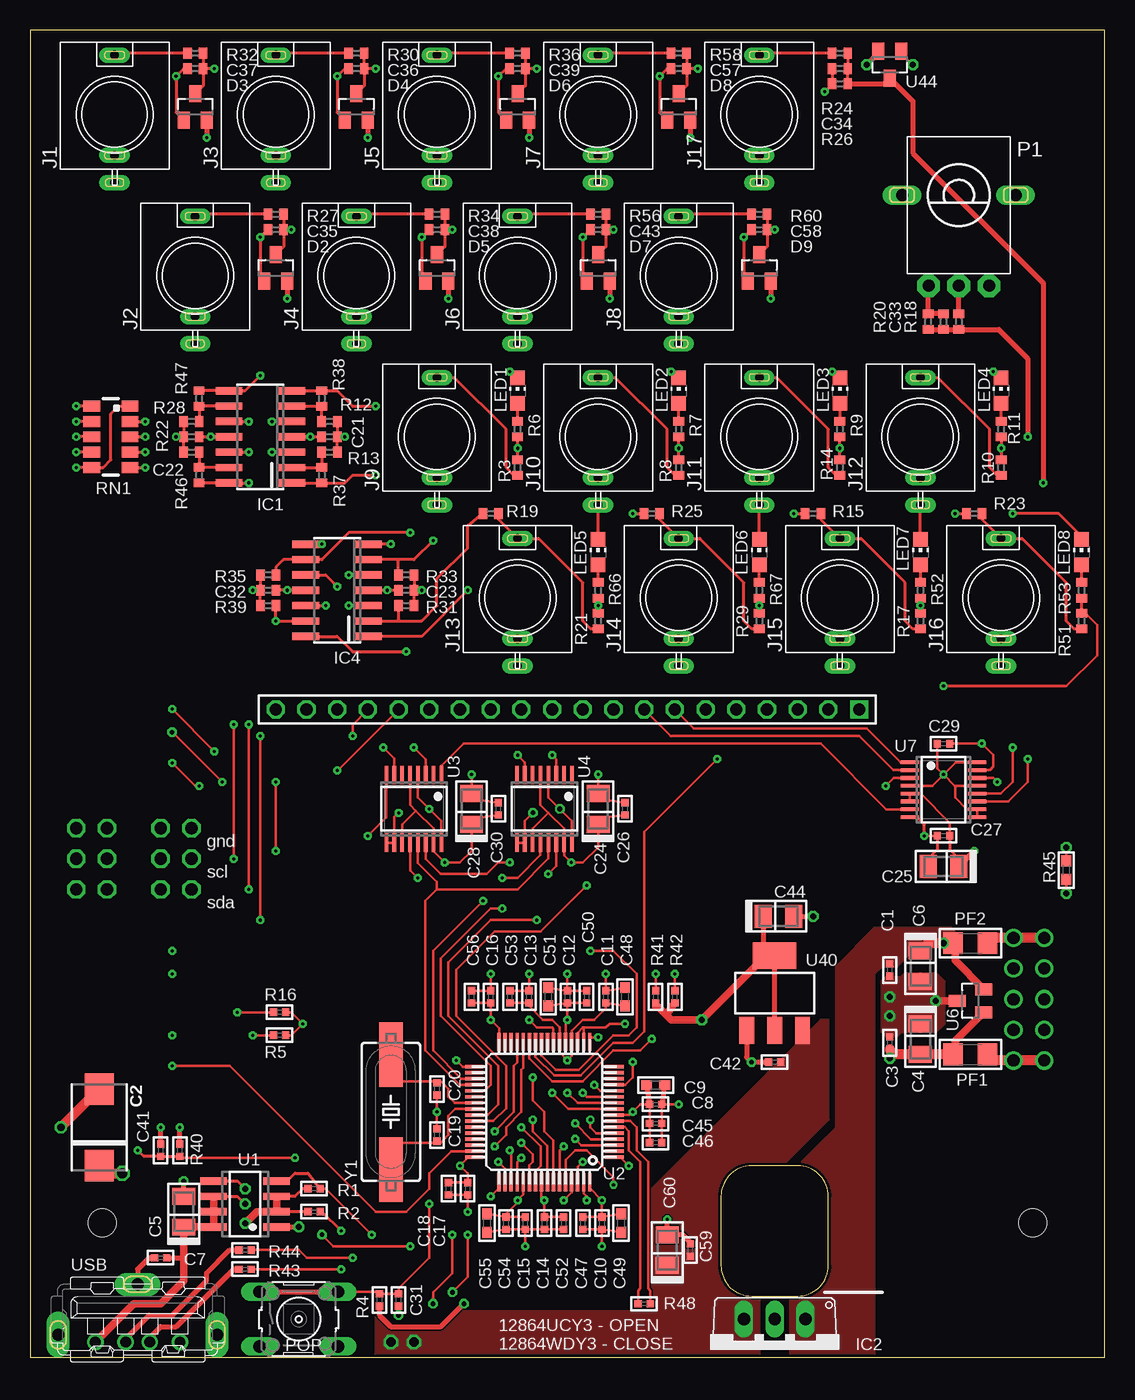
[diagram p3: board, top side]
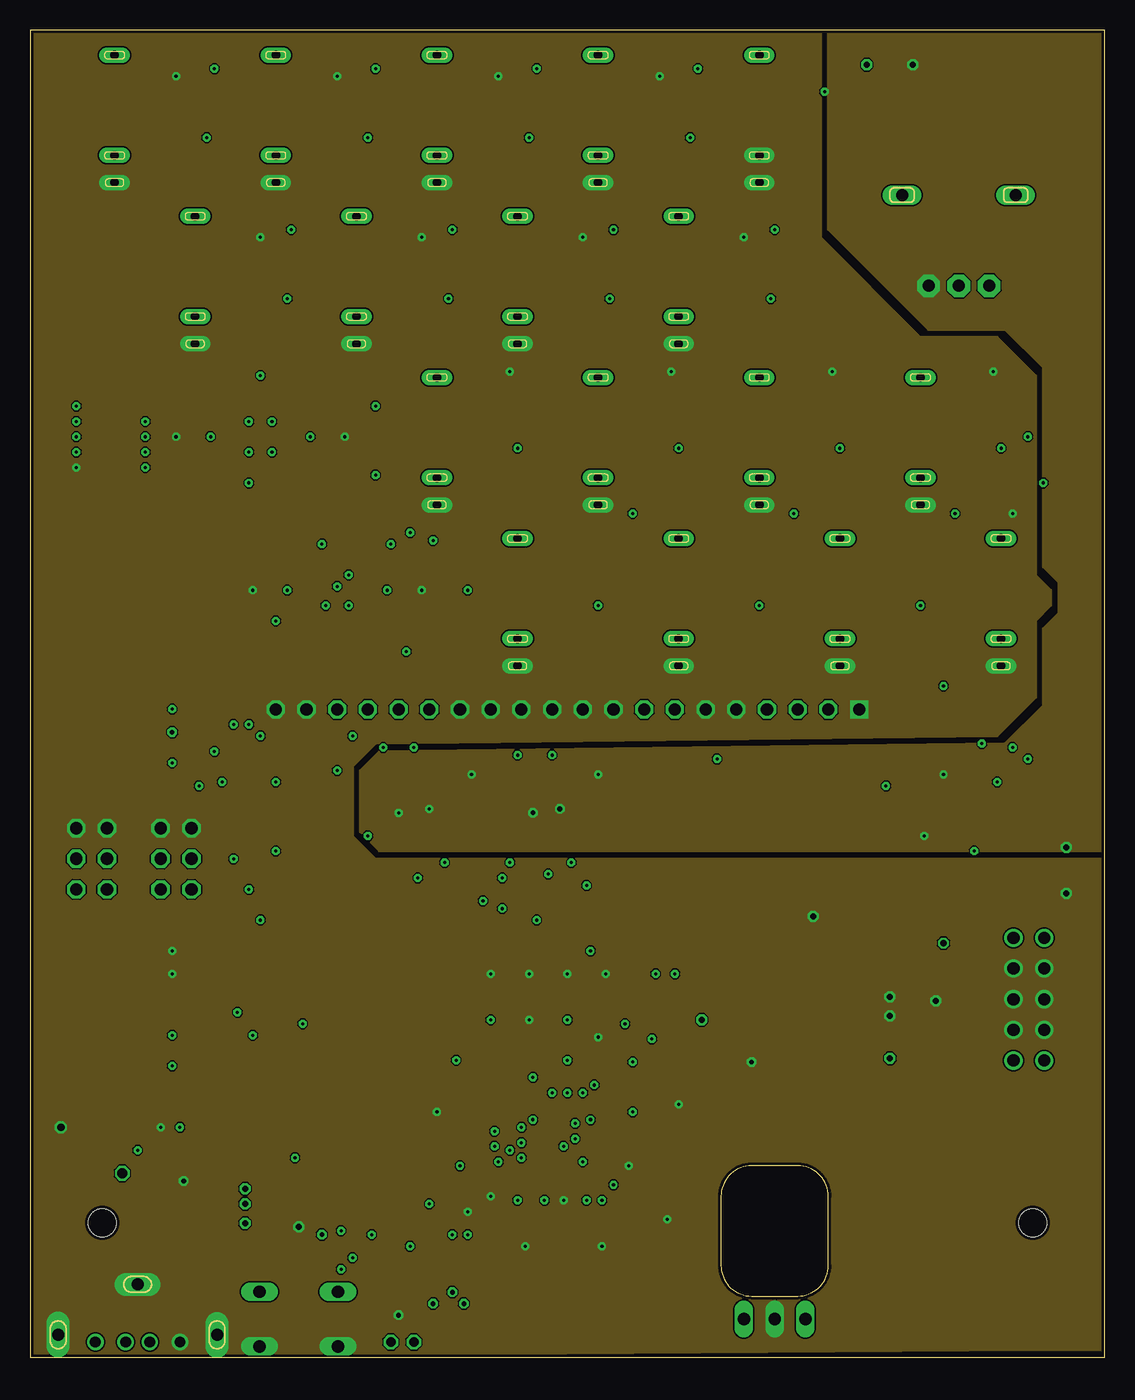
[diagram p4: board, inner layer GND]
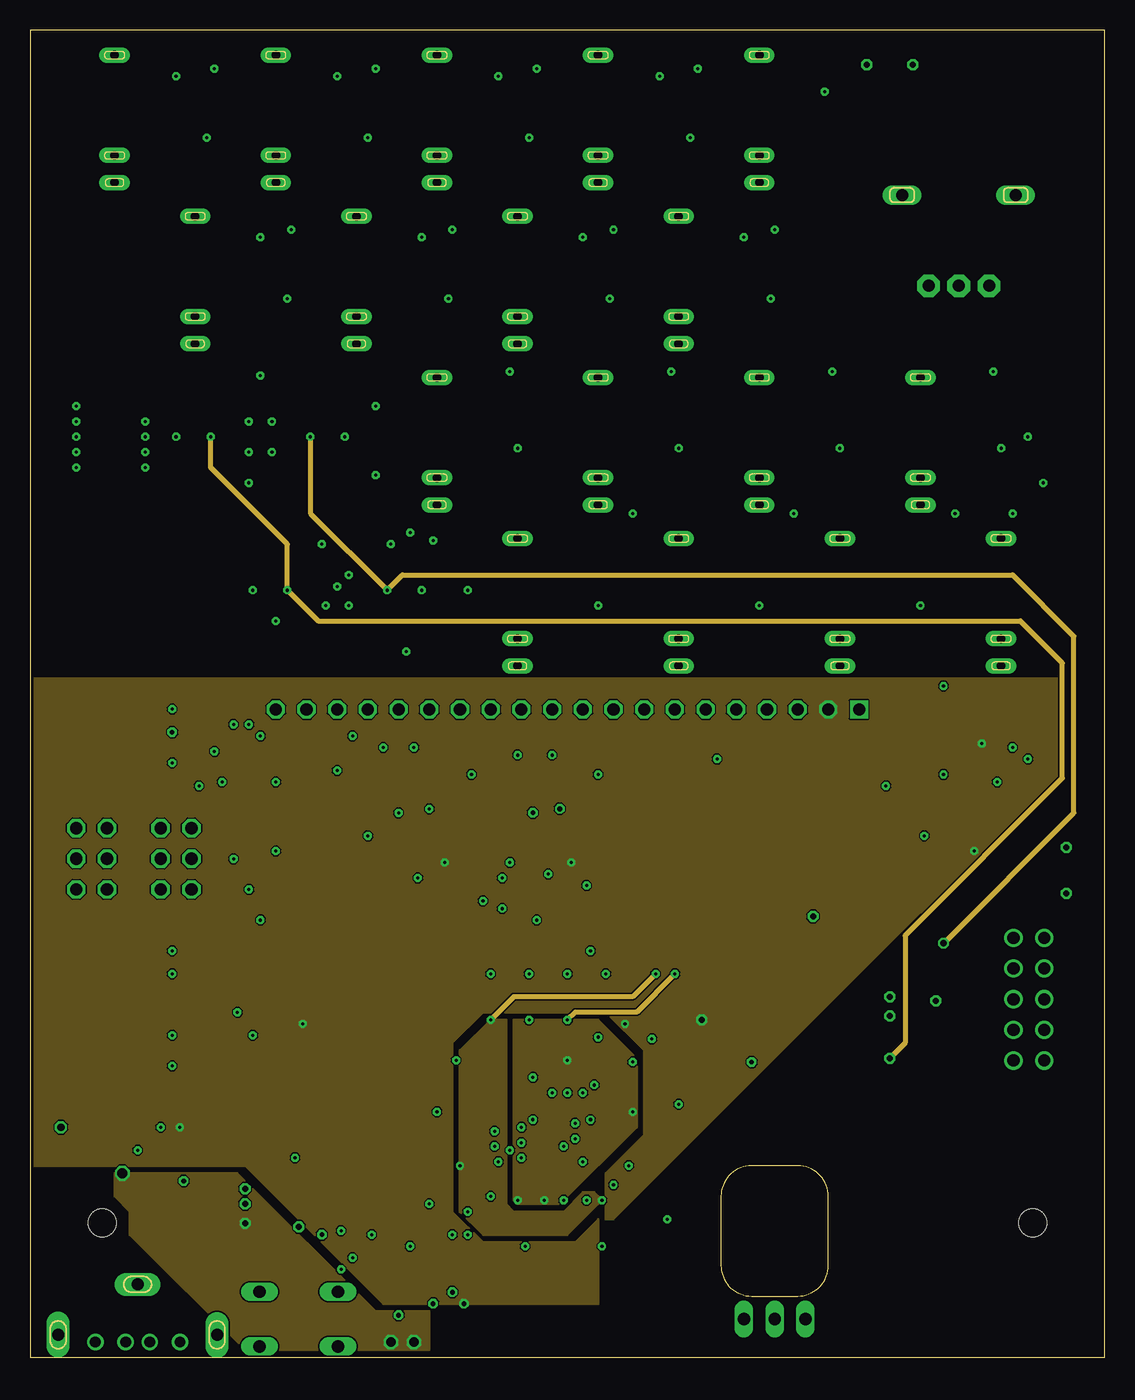
[diagram p5: board, inner layer PWR]
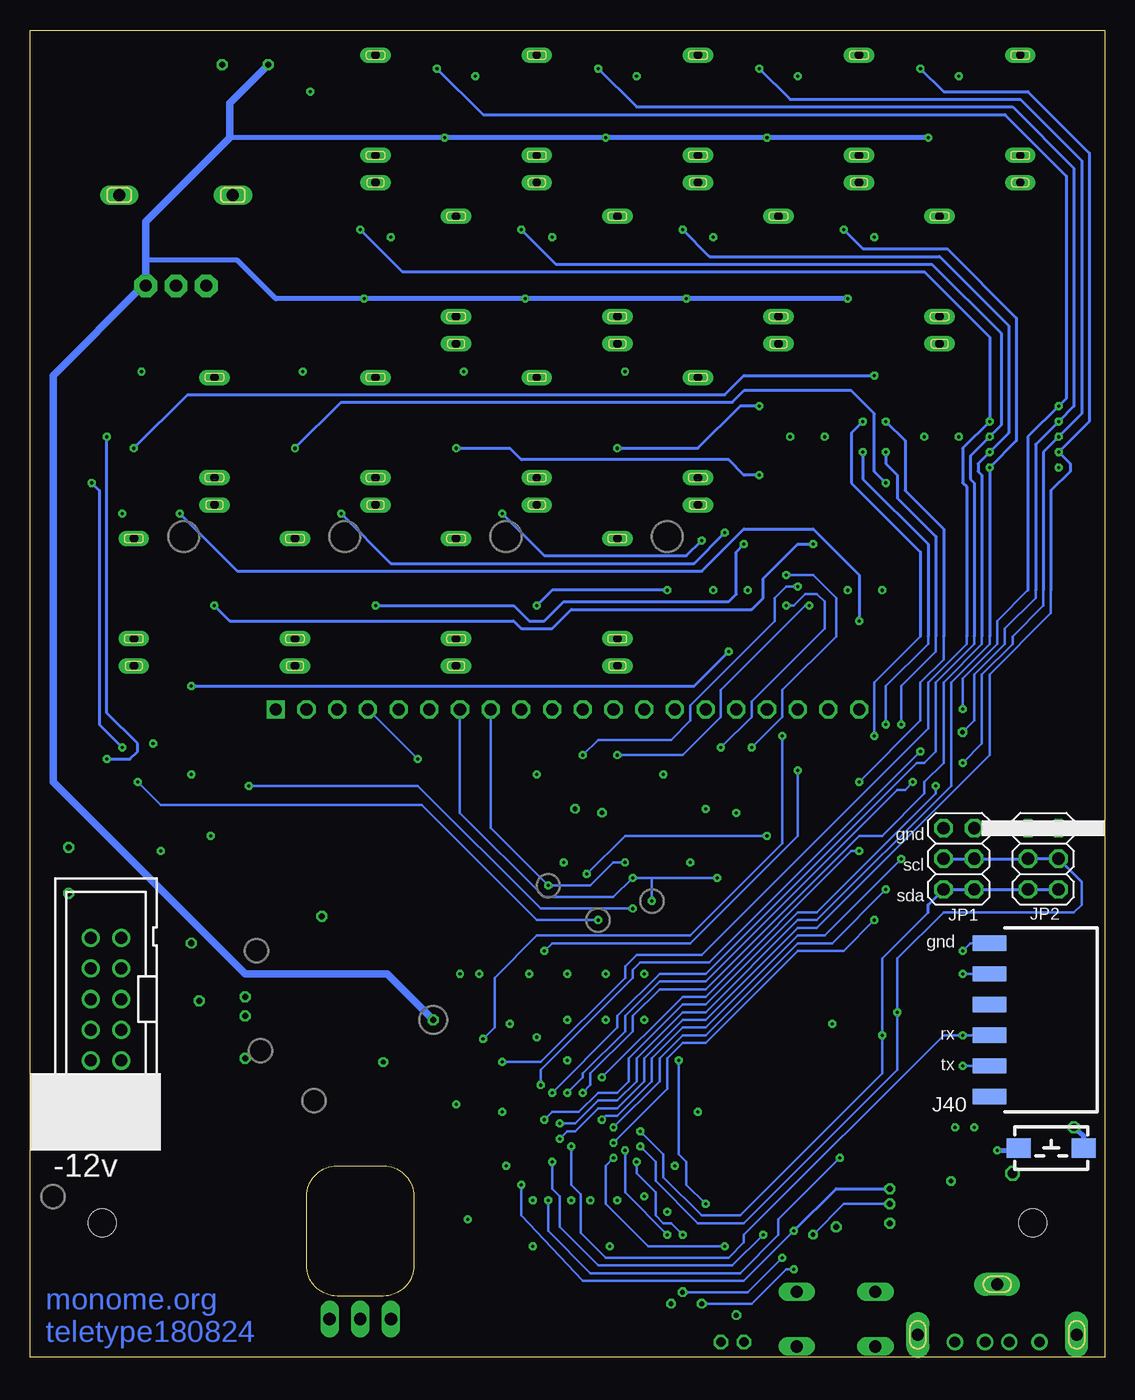
[diagram p6: board, bottom side, seen from below]

Size 88.9 x 109.86 mm. Coordinates in mm from the lower left corner, seen from the top.
Outline: 0,0 88.9,0 88.9,109.86 0,109.86 0,0
Outline: 57.15,13.34 57.15,7.62 arc90 59.69,5.08 63.5,5.08 arc90 66.04,7.62 66.04,13.34 arc90 63.5,15.88 59.69,15.88 arc90 57.15,13.34
Copper layers (1*2+3*16): Top 0.035mm / dielectric 1.5mm / GND 0.035mm / dielectric 0.15mm / PWR 0.035mm / dielectric 0.2mm / Bottom 0.035mm
Design rules "default *": minimum track width 5mil, minimum drill 8mil, track to track 5mil, track to pad 5mil, pad to pad 5mil, via to via 5mil, smd to smd 0mil, copper to edge 10mil, drill to drill 10mil, minimum pad ring 1mil, minimum via ring 8mil, stop-mask expansion 2mil, vias tented up to drill 0mil, thermal gap 0mil

### Footprints (pad centres in the part's own frame; a part is rotated, then mirrored left to right if it is on the bottom)
C0402 = smd 0.6 x 0.6: 1 -0.508,0; 2 0.508,0
C7343-43 = smd 2.6 x 2.4: + 3.175,0; - -3.175,0
C1206/T = smd 1.4 x 1.9: + 1.27,0; - -1.27,0
C0603 = smd 0.9 x 0.8: 1 -0.762,0; 2 0.762,0
C0402' = smd 0.7 x 0.9: 1 -0.65,0; 2 0.65,0
SOT23 = smd 1 x 1.4: 1 -0.95,-1.1; 2 0.95,-1.1; 3 0,1.1
SO14 = smd 0.6 x 2.2: 1 -3.81,-2.6; 2 -2.54,-2.6; 3 -1.27,-2.6; 4 0,-2.6; 5 1.27,-2.6; 6 2.54,-2.6; 7 3.81,-2.6; 8 3.81,2.6; 9 2.54,2.6; 10 1.27,2.6; 11 0,2.6; 12 -1.27,2.6; 13 -2.54,2.6; 14 -3.81,2.6
TO220V = drill 1.016 long: 1 -2.54,-2.54; 2 0,-2.54; 3 2.54,-2.54
WQP-PJ301M-12_JACK = drill 0.7 pad 1.27 long: SLEEVE 0,-5.63; TIP 0,4.92; TS 0,-3.38
ISP-ROW = smd 1.27 x 2.794: 1 -6.35,0; 2 -3.81,0; 3 -1.27,0; 4 1.27,0; 5 3.81,0; 6 6.35,0
2X03 = drill 1.016 octagon: 1 -2.54,-1.27; 2 -2.54,1.27; 3 0,-1.27; 4 0,1.27; 5 2.54,-1.27; 6 2.54,1.27
CHIP-LED0805 = smd 1.2 x 1.2: A 0,-1.05; C 0,1.05
SHAPES_POT-ALPS_ALPS_POT_VERTICAL_PS = drill 1 pad 1.88 octagon: P$1 -2.5,7.5; P$2 0,7.5; P$3 2.5,7.5 | drill 1 pad 1.6 long: P$4 -4.7,0; P$5 4.7,0
F1206 = smd 1.6 x 1.803: 1 -1.429,0; 2 1.429,0
SWITCH-OMRON_B3F-10XX = drill 1.016 long: 1 -3.251,2.261; 2 3.251,2.261; 3 -3.251,-2.261; 4 3.251,-2.261
R0402 = smd 0.6 x 0.6: 1 -0.508,0; 2 0.508,0
R0402' = smd 0.7 x 0.9: 1 -0.65,0; 2 0.65,0
R0603 = smd 0.9 x 0.8: 1 -0.762,0; 2 0.762,0
MNR35 = smd 0.9 x 1.4: 1 -2.54,1.587; 2 -1.27,1.587; 3 0,1.587; 4 1.27,1.587; 5 2.54,1.587; 6 2.54,-1.587; 7 1.27,-1.587; 8 0,-1.587; 9 -1.27,-1.587; 10 -2.54,-1.587
PANASONIC-EVQ = smd 2 x 1.6: 1 2.7,0; 2 -2.7,0
SO08 = smd 0.6 x 2.2: 1 -1.905,-2.6; 2 -0.635,-2.6; 3 0.635,-2.6; 4 1.905,-2.6; 5 1.905,2.6; 6 0.635,2.6; 7 -0.635,2.6; 8 -1.905,2.6
TQFP64-10X10 = smd 1.5 x 0.28: 1 -5.8,3.75; 2 -5.8,3.25; 3 -5.8,2.75; 4 -5.8,2.25; 5 -5.8,1.75; 6 -5.8,1.25; 7 -5.8,0.75; 8 -5.8,0.25; 9 -5.8,-0.25; 10 -5.8,-0.75; 11 -5.8,-1.25; 12 -5.8,-1.75; 13 -5.8,-2.25; 14 -5.8,-2.75; 15 -5.8,-3.25; 16 -5.8,-3.75; 33 5.8,-3.75; 34 5.8,-3.25; 35 5.8,-2.75; 36 5.8,-2.25; 37 5.8,-1.75; 38 5.8,-1.25; 39 5.8,-0.75; 40 5.8,-0.25; 41 5.8,0.25; 42 5.8,0.75; 43 5.8,1.25; 44 5.8,1.75; 45 5.8,2.25; 46 5.8,2.75; 47 5.8,3.25; 48 5.8,3.75 | smd 0.28 x 1.5: 17 -3.75,-5.8; 18 -3.25,-5.8; 19 -2.75,-5.8; 20 -2.25,-5.8; 21 -1.75,-5.8; 22 -1.25,-5.8; 23 -0.75,-5.8; 24 -0.25,-5.8; 25 0.25,-5.8; 26 0.75,-5.8; 27 1.25,-5.8; 28 1.75,-5.8; 29 2.25,-5.8; 30 2.75,-5.8; 31 3.25,-5.8; 32 3.75,-5.8; 49 3.75,5.8; 50 3.25,5.8; 51 2.75,5.8; 52 2.25,5.8; 53 1.75,5.8; 54 1.25,5.8; 55 0.75,5.8; 56 0.25,5.8; 57 -0.25,5.8; 58 -0.75,5.8; 59 -1.25,5.8; 60 -1.75,5.8; 61 -2.25,5.8; 62 -2.75,5.8; 63 -3.25,5.8; 64 -3.75,5.8
TSSOP16 = smd 0.3 x 1.5: 1 -2.275,-2.8; 2 -1.625,-2.8; 3 -0.975,-2.8; 4 -0.325,-2.8; 5 0.325,-2.8; 6 0.975,-2.8; 7 1.625,-2.8; 8 2.275,-2.8; 9 2.275,2.8; 10 1.625,2.8; 11 0.975,2.8; 12 0.325,2.8; 13 -0.325,2.8; 14 -0.975,2.8; 15 -1.625,2.8; 16 -2.275,2.8
SOT223 = smd 1.219 x 2.235: 1 -2.311,-3.099; 2 0,-3.099; 3 2.311,-3.099 | smd 3.6 x 2.2: 4 0,3.099
OLED-ALEPH = drill 1 pad 1.5 square: 1 24.13,21.25 | drill 1 pad 1.5 octagon: 2 21.59,21.25; 3 19.05,21.25; 4 16.51,21.25; 5 13.97,21.25; 6 11.43,21.25; 7 8.89,21.25; 8 6.35,21.25; 9 3.81,21.25; 10 1.27,21.25; 11 -1.27,21.25; 12 -3.81,21.25; 13 -6.35,21.25; 14 -8.89,21.25; 15 -11.43,21.25; 16 -13.97,21.25; 17 -16.51,21.25; 18 -19.05,21.25; 19 -21.59,21.25; 20 -24.13,21.25 | hole 2.286: 38.5,-21.25; -38.5,-21.25
SHAPES_PONY_MOLEX-USB = drill 0.9 pad 1.3: 1 -3.5,-1.9; 2 -1,-1.9; 3 1,-1.9; GND 3.5,-1.9 | drill 1 pad 1.9 long: M1 -6.575,-1.295; M2 6.575,-1.305; M4 0,2.88
PAK100/2500-10 = drill 1 pad 1.422: 1 -5.08,-1.27; 2 -5.08,1.27; 3 -2.54,-1.27; 4 -2.54,1.27; 5 0,-1.27; 6 0,1.27; 7 2.54,-1.27; 8 2.54,1.27; 9 5.08,-1.27; 10 5.08,1.27
HC49UP = smd 5.334 x 1.93: 1 -4.763,0; 2 4.763,0

### Placement (x,y rotation side)
C1  71.12,26.04 270 top
C2  5.71,19.05 270 top
C3  71.12,32.07 90 top
C4  73.66,26.35 90 top
C5  12.7,12.06 270 top
C6  73.66,32.38 90 top
C7  10.79,8.26 0 top
C8  51.75,20.95 180 top
C9  51.75,22.54 180 top
C10  47.31,11.11 90 top
C11  47.62,29.84 270 top
C12  44.45,29.84 270 top
C13  41.27,29.84 270 top
C14  42.55,11.11 90 top
C15  40.96,11.11 90 top
C16  38.1,29.84 270 top
C17  36.2,13.97 90 top
C18  34.61,13.97 90 top
C19  33.66,18.41 270 top
C20  33.66,22.23 90 top
C21  100n  [C0402']  24.77,76.2 0 top
C22  100n  [C0402']  13.34,76.2 0 top
C23  100n  [C0402']  31.11,63.5 0 top
C24  46.99,45.4 270 top
C25  75.56,40.64 0 top
C26  49.21,45.4 270 top
C27  75.56,43.18 0 top
C28  36.51,45.4 270 top
C29  75.56,50.8 0 top
C30  38.73,45.4 270 top
C31  30.48,4.76 270 top
C32  100n  [C0402']  19.68,63.5 0 top
C33  33n  [C0402']  75.56,85.72 90 top
C34  1n  [C0402']  66.99,106.68 180 top
C35  1n  [C0402']  20.32,93.34 180 top
C36  1n  [C0402']  26.99,106.68 180 top
C37  1n  [C0402']  13.65,106.68 180 top
C38  1n  [C0402']  33.66,93.34 180 top
C39  1n  [C0402']  40.32,106.68 180 top
C41  10.79,17.14 90 top
C42  61.59,24.45 0 top
C43  1n  [C0402']  46.99,93.34 180 top
C44  61.91,36.51 180 top
C45  51.75,19.37 180 top
C46  51.75,17.78 180 top
C47  45.72,11.11 90 top
C48  49.21,29.84 270 top
C49  48.9,11.11 90 top
C50  46.04,29.84 270 top
C51  42.86,29.84 270 top
C52  44.13,11.11 90 top
C53  39.69,29.84 270 top
C54  39.37,11.11 90 top
C55  37.78,11.11 90 top
C56  36.51,29.84 270 top
C57  1n  [C0402']  53.66,106.68 180 top
C58  1n  [C0402']  60.33,93.34 180 top
C59  54.61,8.89 270 top
C60  52.7,8.89 270 top
D2  20.32,90.17 0 top
D3  13.65,103.5 0 top
D4  26.99,103.5 0 top
D5  33.66,90.17 0 top
D6  40.32,103.5 0 top
D7  46.99,90.17 0 top
D8  53.66,103.5 0 top
D9  60.33,90.17 0 top
IC1  19.05,76.2 90 top
IC2  61.59,0.64 180 top
IC4  25.4,63.5 90 top
J1  6.99,102.87 0 top
J2  13.65,89.53 0 top
J3  20.32,102.87 0 top
J4  26.99,89.53 0 top
J5  33.66,102.87 0 top
J6  40.32,89.53 0 top
J7  46.99,102.87 0 top
J8  53.66,89.53 0 top
J9  33.66,76.2 0 top
J10  46.99,76.2 0 top
J11  60.33,76.2 0 top
J12  73.66,76.2 0 top
J13  40.32,62.87 0 top
J14  53.66,62.87 0 top
J15  66.99,62.87 0 top
J16  80.33,62.87 0 top
J17  60.33,102.87 0 top
J40  9.53,27.94 270 bottom
JP1  12.06,41.27 90 bottom
JP2  5.08,41.27 90 bottom
LED1  40.32,80.01 0 top
LED2  53.66,80.01 0 top
LED3  66.99,80.01 0 top
LED4  80.33,80.01 0 top
LED5  46.99,66.67 0 top
LED6  60.33,66.67 0 top
LED7  73.66,66.67 0 top
LED8  87,66.67 0 top
P1  76.83,96.2 180 top
PF1  77.79,25.08 180 top
PF2  77.79,34.29 180 top
POP  22.23,3.17 0 top
R1  23.5,13.97 180 top
R2  23.5,12.06 180 top
R3  1k  [R0402']  40.32,73.66 270 top
R4  28.89,4.76 270 top
R5  20.64,26.67 0 top
R6  10k  [R0402']  40.32,76.83 90 top
R7  10k  [R0402']  53.66,76.83 90 top
R8  1k  [R0402']  53.66,73.66 270 top
R9  10k  [R0402']  66.99,76.83 90 top
R10  1k  [R0402']  80.33,73.66 270 top
R11  10k  [R0402']  80.33,76.83 90 top
R12  10k  [R0402']  24.77,77.47 180 top
R13  10k  [R0402']  24.77,74.93 180 top
R14  1k  [R0402']  66.99,73.66 270 top
R15  30k  [R0402']  64.77,69.85 0 top
R16  20.64,28.57 0 top
R17  1k  [R0402']  73.66,60.96 270 top
R18  10k  [R0402']  76.83,85.72 270 top
R19  30k  [R0402']  38.1,69.85 0 top
R20  31k6  [R0402']  74.3,85.72 90 top
R21  1k  [R0402']  46.99,60.96 270 top
R22  10k  [R0402']  13.34,74.93 0 top
R23  30k  [R0402']  78.11,69.85 0 top
R24  30k  [R0402']  66.99,107.95 0 top
R25  30k  [R0402']  51.44,69.85 0 top
R26  10k  [R0402']  66.99,105.41 0 top
R27  30k  [R0402']  20.32,94.61 0 top
R28  10k  [R0402']  13.34,77.47 0 top
R29  1k  [R0402']  60.33,60.96 270 top
R30  30k  [R0402']  26.99,107.95 0 top
R31  10k  [R0402']  31.11,62.23 180 top
R32  30k  [R0402']  13.65,107.95 0 top
R33  10k  [R0402']  31.11,64.77 180 top
R34  30k  [R0402']  33.66,94.61 0 top
R35  10k  [R0402']  19.68,64.77 0 top
R36  30k  [R0402']  40.32,107.95 0 top
R37  20k  [R0402']  24.13,73.03 270 top
R38  20k  [R0402']  24.13,79.38 90 top
R39  10k  [R0402']  19.68,62.23 0 top
R40  12.38,17.14 90 top
R41  51.75,29.84 270 top
R42  53.34,29.84 270 top
R43  17.78,7.3 180 top
R44  17.78,8.89 180 top
R45  85.72,40.32 270 top
R46  20k  [R0402']  13.97,73.03 270 top
R47  20k  [R0402']  13.97,79.38 90 top
R48  50.8,4.45 0 top
R51  1k  [R0402']  87,60.96 270 top
R52  20k  [R0402']  73.66,63.5 90 top
R53  20k  [R0402']  87,63.5 90 top
R56  30k  [R0402']  46.99,94.61 0 top
R58  30k  [R0402']  53.66,107.95 0 top
R60  30k  [R0402']  60.33,94.61 0 top
R66  20k  [R0402']  46.99,63.5 90 top
R67  20k  [R0402']  60.33,63.5 90 top
RN1  6.67,76.2 270 top
SW40  4.42,17.33 0 bottom
U1  17.78,12.7 90 top
U2  42.55,20.32 180 top
U3  31.75,45.4 180 top
U4  42.55,45.4 180 top
U6  77.79,29.53 90 top
U7  75.56,46.99 270 top
U40  61.59,30.16 0 top
U44  71.12,107 180 top
U$1  44.45,32.38 0 top
USB  8.89,3.17 0 top
X1  82.63,29.65 90 bottom
Y1  29.84,20.32 90 top

### Tracks (layer width: path | path; a pad name or v marks a point on that pad's centre or on a via)
+3V3  (via drill 0.25, 0.38, 0.5)
  Top 0.203: C29.2 v78.74,50.8 79.69,49.85 79.69,48.9 79.41,48.62 U7.15 | 42.86,45.09 44.17,43.78 U4.15 44.17,41.55 v44.77,40.96 45.72,40.96 46.99,42.23 C24.+ 47.18,44.64 C26.2 | 42.86,45.09 42.22,45.73 U4.5 | U4.11 41.57,43.79 42.86,45.09 | 31.91,45.24 33.38,43.78 U3.15 33.38,41.87 v34.29,40.96 35.56,40.96 36.51,41.91 C28.+ 37.02,44.64 C30.2 | 31.91,45.24 31.43,45.73 U3.5 | U3.11 30.77,44.11 31.91,45.24 | U7.6 U7.5 73.67,46.66 76.07,44.26 C27.2 | U2.19 45.3,26.88 45.72,27.3 | 45.72,27.3 47.62,27.3 47.94,27.62 v49.21,27.62 | U2.18 45.8,27.23 45.72,27.3 | U44.2 70.17,107.95 | R16.2 21.59,28.57 v22.54,27.62 21.59,26.67 R5.2
  Top 0.254: C27.2 76.07,42.04 76.83,41.27 C25.+
  Top 0.406: C44.+ 60.64,34.21 U40.4 U40.2 | R4.2 28.89,3.49 29.84,2.54 33.97,2.54 v35.88,4.45 | R40.2 v12.38,19.05 | C25.+ v78.11,41.91 | 70.17,107.95 v69.22,107 | R41.2 51.75,29.02 | D3.2 v14.6,100.97 v14.61,100.97 | D8.2 v54.61,100.97 | D6.2 v41.27,100.97 | D4.2 v27.94,100.97 | D2.2 v21.27,87.63 | D5.2 v34.6,87.63 v34.61,87.63 | D7.2 v47.94,87.63 | D9.2 v61.27,87.63 v61.28,87.63
  Top 0.61: U40.4 60.64,33.02 v55.56,27.94 53.02,27.94 52.61,28.35 | R42.2 52.61,28.35 | 51.75,29.02 51.94,29.02 52.61,28.35
  Bottom 0.406: v14.61,100.97 v27.94,100.97 v41.27,100.97 v54.61,100.97 72.39,100.97 | v21.27,87.63 v34.61,87.63 v47.94,87.63 v61.28,87.63 68.58,87.63 71.75,90.81 79.33,90.81
  Bottom 0.61: v55.56,27.94 59.37,31.75 71.12,31.75 87,47.62 87,81.28 79.57,88.7 P1.P$1 79.33,90.81 79.33,94.02 72.39,100.97 72.39,103.82 v69.22,107
  pour PWR: 47.62,11.43 48.26,11.43 73.66,36.83 78.74,36.83 85.09,43.18 85.09,56.2 0,56.2 0,15.88 17.78,15.88 29.21,4.45 46.99,4.45 46.99,11.43 45.09,9.53 37.47,9.53 34.92,12.06 34.92,26.04 37.47,28.57 47.62,28.57 50.8,25.4 50.8,18.41 47.62,15.24
+5V  (via drill 0.5, 0.8)
  Top 0.254: R2.2 U1.2 | R1.2 22.54,13.97 21.91,13.34 U1.3
  Top 0.61: v17.78,11.11 18.73,12.06 U1.2 U1.3
  Top 0.813: C2.+ 6.35,15.24 v7.62,15.24
  other vias: 29.84,1.27 31.75,1.27
  pour Top: 66.04,27.94 66.04,19.68 62.23,15.88 62.23,6.99 60.33,5.08 60.33,0 28.57,0 28.57,3.81 51.44,3.81 51.44,13.97 65.41,27.94
  pour PWR: 33.02,3.81 33.02,0.64 17.78,0.64 8.26,10.16 8.26,12.06 6.99,13.34 6.99,15.24 17.14,15.24 28.57,3.81
+12V  (via drill 0.25, 0.5)
  Top 0.254: IC1.4 v23.18,76.2 C21.1 | IC4.4 v29.53,63.5 C23.1
  Top 0.61: PF2.2 76.52,34.29 76.52,32.85 U6.2
  Top 0.813: PF2.2 v75.56,34.29 74.3,34.29 C6.+
  PWR 0.406: v75.56,34.29 86.36,45.09 86.36,59.69 81.28,64.77 30.8,64.77 v29.53,63.5 23.18,69.85 v23.18,76.2
  pour Top: 76.2,34.29 73.66,34.29 71.75,32.38 70.48,32.38 69.85,31.75 69.85,0 62.87,0 62.87,15.24 66.67,19.05 66.67,32.38 69.85,35.56 76.2,35.56 76.83,34.92
+IN
  Top 0.813: X1.10 X1.9 79.18,34.73 PF2.1
-12V  (via drill 0.25, 0.5)
  Top 0.254: C22.2 v14.92,76.2 IC1.11 | IC4.11 v21.27,63.5 C32.2
  Top 0.406: v71.12,24.77 70.99,25.4 C1.2
  Top 0.61: PF1.2 76.52,25.08 76.52,26.21 U6.1
  Top 0.813: PF1.2 C4.- 71.31,25.08 C1.2
  PWR 0.406: v71.12,24.77 72.39,26.04 72.39,34.92 85.41,47.94 85.41,57.47 81.92,60.96 23.81,60.96 v21.27,63.5 21.27,67.31 14.92,73.66 v14.92,76.2
-IN
  Top 0.813: X1.2 X1.1 79.25,24.57 PF1.1
A00  (via drill 0.25)
  Top 0.203: U2.3 45.61,17.57 v45.09,18.1
  Top 0.254: RN1.7 v3.81,74.93 | R32.2 C37.1 | C37.1 14.3,105.25 D3.3 | v15.24,106.68 C37.1
  Bottom 0.203: 4.45,63.5 4.45,61.59 9.53,56.52 9.53,49.85 23.81,35.56 25.4,35.56 33.02,27.94 34.92,27.94 38.1,24.77 38.1,22.86 40.32,20.64 41.91,20.64 43.81,18.73 44.45,18.73 v45.09,18.1
  Bottom 0.254: 4.45,63.5 4.45,71.75 2.86,73.34 2.86,73.98 v3.81,74.93 1.27,77.47 1.27,99.69 6.35,104.78 13.34,104.78 v15.24,106.68
A01  (via drill 0.25)
  Top 0.203: U2.4 46.38,18.07 v45.09,19.37
  Top 0.254: RN1.5 v9.53,73.66 | R27.2 C35.1 | C35.1 20.97,91.92 D2.3 | v21.59,93.34 C35.1
  Bottom 0.203: 9.53,59.69 9.53,59.05 12.7,55.88 12.7,47.31 23.81,36.2 25.4,36.2 33.02,28.57 34.92,28.57 38.73,24.77 38.73,22.86 40.32,21.27 41.91,21.27 43.81,19.37 v45.09,19.37
  Bottom 0.254: 9.53,59.69 v9.53,73.66 7.3,75.88 7.3,86.04 13.02,91.76 20,91.76 v21.59,93.34
A02  (via drill 0.25)
  Top 0.203: U2.5 46.84,18.57 46.35,19.05 v46.35,19.68 | v13.97,47.31 13.65,47.31 v11.75,49.21
  Top 0.254: RN1.8 v3.81,76.2 | C36.1 R30.2 | C36.1 27.64,105.25 D4.3 | v28.57,106.68 C36.1
  Bottom 0.203: 5.08,63.5 5.08,62.23 7.62,59.69 7.62,59.05 10.16,56.52 10.16,50.8 v11.75,49.21 | v46.35,19.68 45.72,20.32 43.5,20.32 41.91,21.91 40.32,21.91 39.37,22.86 39.37,24.77 34.92,29.21 33.02,29.21 25.4,36.83 23.81,36.83 13.97,46.67 v13.97,47.31
  Bottom 0.254: 5.08,63.5 5.08,74.93 v3.81,76.2 1.91,78.11 1.91,99.06 6.99,104.14 26.04,104.14 v28.57,106.68
A03  (via drill 0.25)
  Top 0.203: U2.9 44.52,20.57 v43.18,21.91
  Top 0.254: RN1.4 v9.53,74.93 | C38.1 34.3,91.92 D5.3 | v34.92,93.34 C38.1 | R34.2 C38.1
  Bottom 0.203: 10.16,59.69 10.16,59.05 13.34,55.88 13.34,49.21 14.92,47.62 14.92,46.67 18.41,43.18 20.32,43.18 33.02,30.48 36.83,30.48 39.05,28.26 39.05,26.99 42.55,23.5 42.55,22.54 v43.18,21.91
  Bottom 0.254: 10.16,59.69 10.16,73.03 10.48,73.34 10.48,73.98 v9.53,74.93 7.94,76.52 7.94,85.41 13.65,91.12 32.7,91.12 v34.92,93.34
A04  (via drill 0.25, 0.38)
  Top 0.203: U2.10 45.29,21.07 v44.45,21.91 | v11.75,51.75 v15.88,47.62
  Top 0.254: RN1.9 v3.81,77.47 | R36.2 C39.1 | C39.1 40.97,105.25 D6.3 | v41.91,106.68 C39.1
  Bottom 0.203: 5.71,63.5 5.71,62.87 8.26,60.33 8.26,59.05 10.79,56.52 10.79,52.7 v11.75,51.75 | v44.45,21.91 43.18,23.18 43.18,23.5 39.69,26.99 39.69,28.26 36.83,31.11 33.02,31.11 17.14,46.99 16.51,46.99 v15.88,47.62
  Bottom 0.254: 5.71,63.5 5.71,75.56 v3.81,77.47 2.54,78.74 2.54,98.42 7.62,103.5 38.73,103.5 v41.91,106.68
A05  (via drill 0.25)
  Top 0.203: U2.11 46.06,21.57 v45.72,21.91
  Top 0.254: RN1.3 v9.53,76.2 | C43.1 47.64,91.92 D7.3 | R56.2 C43.1 | v48.26,93.34 C43.1
  Bottom 0.203: 10.79,59.69 10.79,59.05 13.97,55.88 13.97,50.16 14.92,49.21 15.56,49.21 33.02,31.75 36.83,31.75 40.32,28.26 40.32,27.3 v45.72,21.91
  Bottom 0.254: 10.79,59.69 10.79,72.39 11.11,72.71 11.11,74.61 v9.53,76.2 8.57,77.15 8.57,84.77 14.29,90.49 45.4,90.49 v48.26,93.34
A06  (via drill 0.25)
  Top 0.203: U2.12 47.15,22.07 v46.67,22.54 | v15.24,50.16 v11.75,53.66
  Top 0.254: RN1.10 v3.81,78.74 | R58.2 C57.1 | C57.1 54.31,105.25 D8.3 | v55.24,106.68 C57.1
  Bottom 0.203: 6.35,63.5 8.89,60.96 8.89,59.05 11.75,56.2 v11.75,53.66 | v46.67,22.54 46.67,23.81 39.05,31.43 39.05,32.07 38.42,32.7 32.7,32.7 v15.24,50.16
  Bottom 0.254: 6.35,63.5 6.35,76.2 v3.81,78.74 3.17,79.38 3.17,97.79 8.26,102.87 51.44,102.87 v55.24,106.68
A07  (via drill 0.25)
  Top 0.203: U2.13 49.24,22.57 49.85,23.18 v49.85,24.45
  Top 0.254: RN1.2 v9.53,77.47 | R60.2 C58.1 | C58.1 60.98,91.92 D9.3 | v61.59,93.34 C58.1
  Bottom 0.203: 11.43,59.69 11.43,59.05 14.61,55.88 14.61,52.07 33.34,33.34 38.73,33.34 39.69,32.38 39.69,31.43 46.67,24.45 v49.85,24.45
  Bottom 0.254: 11.43,59.69 11.43,72.07 11.75,72.39 11.75,75.25 v9.53,77.47 9.53,84.45 14.92,89.85 58.1,89.85 v61.59,93.34
AGND  (via drill 0.25, 0.38, 0.5)
  Top 0.203: U7.4 74.62,47.31 v75.56,48.26 | v75.56,48.26 76.51,47.31 U7.13 76.53,47.31 76.52,47.31 76.52,46.35 77.51,45.37 U7.10 U7.9 | U7.16 76.57,49.27 v75.56,48.26 | v73.98,43.18 C27.1 | U4.16 44.82,44.4 v43.81,45.4 42.87,46.35 U4.4 | U3.16 34.02,44.4 v33.02,45.4 32.08,46.35 U3.4 | U3.9 U3.10 30.12,44.73 v30.48,45.09 | v41.59,45.09 40.92,44.41 U4.10 U4.9 | C30.1 37.02,46.16 C28.- v36.51,48.26 | C26.1 47.5,46.16 C24.- v46.99,48.26 | C29.1 75.06,48.77 v75.56,48.26 | R45.1 v85.72,42.23 | U44.1 72.07,107.95 v73.03,107
  Top 0.254: v65.72,104.78 R26.1 C34.2 | U7.8 73.39,44.72 73.98,44.13 v73.98,43.18 | C25.- 74.3,41.27 75.06,42.04 C27.1
  Top 0.406: P1.P$3 74.3,88.66 R20.2 C33.2
  pour GND: 88.9,109.86 88.9,41.91 28.89,41.91 27.3,43.5 27.3,48.58 28.89,50.16 80.64,50.8 83.82,53.98 83.82,60.33 85.09,61.59 85.09,64.14 83.82,65.41 83.82,81.92 80.64,85.09 74.3,85.09 66.04,93.34 66.04,109.86
B08  (via drill 0.25)
  Top 0.203: U2.54 41.3,15.89 41.59,16.19 41.59,16.83 v40.64,17.78 | v19.05,36.2 v19.05,51.44
  Top 0.254: IC1.5 v20,77.47
  Bottom 0.203: 15.24,59.69 19.05,55.88 v19.05,51.44 | v40.64,17.78 36.2,22.23 36.2,24.77 34.92,26.04 33.02,26.04 25.4,33.66 21.59,33.66 v19.05,36.2
  Bottom 0.254: v20,77.47 20.95,76.52 20.95,72.39 15.24,66.67 15.24,59.69
B09  (via drill 0.25)
  Top 0.203: U2.55 41.8,15.44 42.23,15.88 42.23,17.46 v40.64,19.05 | v18.1,52.39 v18.1,38.73
  Top 0.254: IC1.3 v20,74.93
  Bottom 0.203: 14.61,59.69 14.61,59.05 18.1,55.56 v18.1,52.39 | v40.64,19.05 36.83,22.86 36.83,24.77 34.92,26.67 33.02,26.67 25.4,34.29 22.54,34.29 v18.1,38.73
  Bottom 0.254: v20,74.93 20,72.71 14.61,67.31 14.61,59.69
B10  (via drill 0.25)
  Top 0.203: U2.57 42.8,17.53 41.59,18.73 v41.59,19.68 | v16.83,52.39 v16.83,41.27
  Top 0.254: IC1.12 v18.1,74.93
  Bottom 0.203: 13.97,59.69 13.97,58.42 16.83,55.56 v16.83,52.39 | v41.59,19.68 41.27,20 40.32,20 37.47,22.86 37.47,24.77 34.92,27.3 33.02,27.3 25.4,34.92 23.18,34.92 v16.83,41.27
  Bottom 0.254: v18.1,74.93 18.1,73.98 17.14,73.03 17.14,71.12 13.97,67.94 13.97,59.69
B11  (via drill 0.25)
  Top 0.203: U2.58 43.3,17.98 42.55,18.73 42.55,20.32 41.59,21.27 v41.59,23.18 | v20.32,41.91 v20.32,47.62
  Top 0.254: IC1.10 v18.1,77.47
  Bottom 0.203: 13.34,59.69 13.34,57.78 15.24,55.88 15.24,52.7 v20.32,47.62 | v41.59,23.18 34.92,29.84 33.02,29.84 20.95,41.91 v20.32,41.91
  Bottom 0.254: v18.1,77.47 16.51,75.88 16.51,71.75 13.34,68.58 13.34,59.69
CS0
  Top 0.203: U2.36 35.53,22.57 32.7,25.4 32.7,37.78 33.66,38.73 | 33.66,38.73 40.32,38.73 42.87,41.28 U4.13 | U3.13 32.08,40.95 33.66,39.37 33.66,38.73
CS1  (via drill 0.25)
  Top 0.203: U2.37 37.63,22.07 38.1,22.54 38.1,24.13 33.97,28.26 33.97,33.02 38.1,37.15 v39.05,37.15 | U7.3 71.46,47.97 v70.8,47.31
  Bottom 0.203: v39.05,37.15 46.67,37.15 56.83,47.31 v70.8,47.31
CS2  (via drill 0.25)
  Top 0.203: U2.27 41.3,24.75 43.18,22.86 45.72,22.86 48.26,25.4 50.48,25.4 v51.44,26.35 | v26.67,51.44 26.67,52.37 U$1.17
  Bottom 0.203: v51.44,26.35 50.48,27.3 50.48,31.43 46.99,34.92 34.29,34.92 26.67,42.55 v26.67,51.44
CV-IN0  (via drill 0.25)
  Top 0.203: U7.12 80.32,46.66 81.28,47.62 v81.28,50.48
  Top 0.254: R24.2 C34.1 R26.2
  Top 0.406: v83.82,72.39 83.82,88.9 73.03,99.69 73.03,103.99 U44.3 70.63,105.41 R26.2
  Bottom 0.254: v83.82,72.39 83.19,71.75 83.19,52.39 v81.28,50.48
CV-IN1  (via drill 0.25)
  Top 0.203: U7.11 80.94,46.02 82.55,47.62 v82.55,49.53
  Top 0.406: v82.55,76.2 82.55,82.66 80.14,85.08 R18.2 C33.1 R20.1
  Bottom 0.254: v82.55,49.53 80.64,49.53 80.01,50.16 80.01,50.8 82.55,53.34 v82.55,76.2
CV-OUT0  (via drill 0.25)
  Top 0.203: U3.3 32.73,49.51 v31.75,50.48
  Top 0.254: IC4.3 v26.35,62.23
  Bottom 0.203: v31.75,50.48 29.21,53.02 29.21,54.29 23.18,60.33 23.18,62.55 23.81,63.18 24.77,63.18 25.72,62.23 v26.35,62.23
CV-OUT1  (via drill 0.25)
  Top 0.203: U3.7 30.12,49.57 v29.21,50.48
  Top 0.254: IC4.5 v26.35,64.77
  Bottom 0.203: v26.35,64.77 24.13,64.77 22.23,62.87 22.23,59.69 26.67,55.24 26.67,53.02 v29.21,50.48
CV-OUT2  (via drill 0.25)
  Top 0.203: U4.3 43.52,49.51 v43.18,49.85
  Top 0.254: IC4.10 24.45,64.77 v25.4,63.82
  Bottom 0.203: v25.4,63.82 26.35,63.82 27.3,62.87 27.3,60.96 34.29,53.98 34.29,52.7 35.88,51.12 41.91,51.12 v43.18,49.85
CV-OUT3  (via drill 0.25)
  Top 0.203: U4.7 40.92,49.25 v40.32,49.85
  Top 0.254: IC4.12 v24.45,62.23
  Bottom 0.203: v24.45,62.23 24.77,62.23 31.75,55.24 31.75,53.02 34.92,49.85 v40.32,49.85
DM
  Top 0.406: USB.2 7.89,1.54 9.84,3.49 11.75,3.49 14.61,6.35 14.61,6.99 16.51,8.89 R44.2
DP
  Top 0.406: USB.3 9.89,1.64 10.79,2.54 12.06,2.54 16.83,7.3 R43.2
GND  (via drill 0.25, 0.38, 0.5, 0.6)
  Top 0.203: C18.1 C17.1 v36.2,12.06 | C19.1 v33.66,20.32 C20.1 | C15.1 C14.1 C52.1 | v41.27,27.94 41.91,27.3 43.18,27.3 43.3,27.19 U2.23 | U2.49 38.8,14.03 v38.1,13.34 | C15.1 v40.96,9.21 | U2.1 48.84,16.57 v49.53,15.88 | v47.62,31.75 C11.1 C48.1 | v38.1,31.75 C16.1 C56.1 | v53.66,20.95 C8.1 C45.1 C46.1 | C10.1 v47.31,9.21 | U2.17 46.35,26.51 v46.99,26.51 | R45.2 v85.72,38.42 | C47.1 C10.1 | C49.1 C10.1 | C55.1 C54.1 C15.1 | C50.1 C12.1 | C51.1 C12.1 | C12.1 v44.45,31.75 | C53.1 C13.1 v41.27,31.75 | U2.61 44.8,13.68 v44.13,13.02
  Top 0.254: v3.81,73.66 RN1.6 6.03,73.66 6.67,74.3 6.67,78.11 7.3,78.74 RN1.1 | LED1.C 40.1,81.06 40.1,81.18 v39.69,81.6 | 53.44,81.06 LED2.C 53.56,81.06 v53.02,81.6 | LED3.C 66.77,81.06 66.77,81.18 v66.36,81.6 | LED4.C 80.11,81.06 80.11,81.18 v79.69,81.6 | C37.2 12.7,106.68 v12.06,106.05 12.06,103.04 D3.1 | C36.2 26.04,106.68 v25.4,106.05 25.4,103.04 D4.1 | C39.2 39.37,106.68 v38.73,106.05 38.73,103.04 D6.1 | C57.2 52.7,106.68 v52.07,106.05 52.07,103.04 D8.1 | C35.2 v19.05,92.71 19.05,89.39 D2.1 | C38.2 v32.38,92.71 32.38,89.39 D5.1 | C43.2 v45.72,92.71 45.72,89.39 D7.1 | C58.2 v59.05,92.71 59.05,89.39 D9.1 | R13.1 C21.2 | C21.2 v26.04,76.2 | R12.1 C21.2 | R28.1 C22.1 | C22.1 v12.06,76.2 | R22.1 C22.1 | C23.2 v32.38,63.5 | R31.1 C23.2 | R33.1 C23.2 | v18.41,63.5 C32.1 | R39.1 C32.1 | R35.1 C32.1 | LED5.C J10.SLEEVE | LED6.C J11.SLEEVE | LED7.C J12.SLEEVE | LED8.C 87,67.94 85.09,69.85 v81.28,69.85
  Top 0.406: U1.1 v22.23,10.79 | C9.1 C8.1 | U40.1 59.28,24.85 v59.69,24.45 C42.1 | C44.- v64.77,36.51 | v30.48,3.49 C31.2 | C5.- v12.7,14.61 | C41.2 v10.79,19.05 | C7.1 9.84,8.26 8.89,7.3 USB.M4 | v52.7,11.43 C60.- 53.98,10.16 54.61,9.53 C59.1
  Top 0.61: U6.3 v74.93,29.53
  Top 0.813: C2.- v2.54,19.05
  Bottom 0.203: J40.2 v11.75,31.75 | J40.1 11.11,34.29 v11.75,33.66
  Bottom 0.406: SW40.1 1.72,18.28 v2.54,19.05
  other vias: 71.12,29.84 71.12,28.26
  pour GND: 0,0 83.19,0.64 88.9,0.64 88.9,41.27 28.57,41.27 26.67,43.18 26.67,48.9 28.57,50.8 80.01,51.44 83.19,54.61 83.19,60.96 84.45,62.23 84.45,63.5 83.19,64.77 83.19,81.28 80.01,84.45 73.66,84.45 65.41,92.71 65.41,109.86 0,109.86
  pour Top: 72.39,31.75 74.93,31.75 75.56,31.11 75.56,27.62 74.93,26.99 72.07,26.99 71.75,26.67 70.8,26.67 70.48,26.99 70.48,31.11 70.8,31.43 72.07,31.43
MISO  (via drill 0.25)
  Top 0.203: U2.41 37.85,20.07 38.73,20.95 38.73,24.13 34.61,28.26 34.61,32.7 38.1,36.2 v41.91,36.2 | U7.14 79.67,47.97 v80.01,47.62
  Bottom 0.203: v80.01,47.62 78.11,45.72 56.52,45.72 46.99,36.2 v41.91,36.2
MOSI  (via drill 0.25)
  Top 0.203: U3.14 32.73,41.25 33.97,40.01 37.78,40.01 38.73,40.96 v39.69,40.96 | U2.42 38.3,19.57 39.37,20.64 39.37,24.13 35.24,28.26 35.24,32.07 38.42,35.24 42.23,35.24 v46.04,39.05 | U7.2 71.4,48.62 68.58,51.44 53,51.44 U$1.8
  Bottom 0.203: v39.69,40.96 40.64,40.96 42.55,39.05 v46.04,39.05 50.8,43.81 U$1.8
N$1  (via drill 0.25, 0.38)
  Top 0.203: U2.51 39.8,17.04 v39.69,17.14 | v36.2,10.16 36.2,6.67 v34.92,5.4 | v26.67,8.26 22.86,8.26 22.23,8.89 R44.1
  Bottom 0.203: v39.69,17.14 39.69,13.65 v36.2,10.16 | v34.92,5.4 29.53,5.4 v26.67,8.26
N$2  (via drill 0.25, 0.38)
  Top 0.203: U2.50 39.3,15.63 v38.73,16.19 | v34.92,10.16 34.92,6.99 33.34,5.4 v33.34,4.45 | R43.1 v25.72,7.3
  Bottom 0.203: v38.73,16.19 38.73,15.24 37.15,13.65 37.15,11.75 36.51,11.11 35.88,11.11 v34.92,10.16 | v33.34,4.45 29.21,4.45 26.35,7.3 v25.72,7.3
N$3  (via drill 0.25)
  Top 0.254: IC1.7 23.91,80.01 R38.2 25.39,80.03 26.67,78.74 v28.57,78.74 | R3.1 v40.32,75.25 R6.1
  Bottom 0.254: v40.32,75.25 33.66,75.25 30.16,78.74 v28.57,78.74
N$4  (via drill 0.25)
  Top 0.203: U3.8 29.48,44.72 v27.94,43.18 | U4.14 43.52,40.66 v42.86,40.01
  Bottom 0.203: v27.94,43.18 39.69,43.18 v42.86,40.01
N$5  (via drill 0.25)
  Top 0.254: IC1.1 23.91,72.39 R37.2 26.02,72.38 26.67,73.03 v28.57,73.03 | R8.1 v53.66,75.25 R7.1
  Bottom 0.254: v53.66,75.25 49.21,75.25 48.26,74.3 31.11,74.3 29.84,73.03 v28.57,73.03
N$6  (via drill 0.25)
  Top 0.254: R46.2 14.19,72.39 IC1.14 v18.1,72.39 | R14.1 v66.99,75.25 R9.1
  Bottom 0.254: v66.99,75.25 63.18,79.06 30.8,79.06 29.84,80.01 20.95,80.01 19.05,78.11 19.05,73.34 v18.1,72.39
N$7  (via drill 0.25)
  Top 0.254: R47.2 14.19,80.01 IC1.8 17.78,80.01 v19.05,81.28 | R11.1 v80.33,75.25 R10.1
  Bottom 0.254: v80.33,75.25 75.88,79.69 31.43,79.69 29.84,81.28 v19.05,81.28
N$8
  Top 0.254: R3.2 40.02,73.01 39.37,73.66 39.37,76.83 35.09,81.12 J9.TIP
N$9
  Top 0.254: R8.2 53.35,73.01 52.7,73.66 52.7,76.83 48.42,81.12 J10.TIP
N$10
  Top 0.254: R14.2 66.69,73.01 66.04,73.66 66.04,76.83 61.76,81.12 J11.TIP
N$11
  Top 0.254: R10.2 80.03,73.01 79.38,73.66 79.38,76.83 75.09,81.12 J12.TIP
N$12
  Top 0.406: R18.1 P1.P$2
N$13  (via drill 0.25)
  Top 0.254: R21.1 v46.99,62.23 R66.1 | v36.2,63.5 32.38,59.69 IC4.1
  Bottom 0.254: v36.2,63.5 45.72,63.5 v46.99,62.23
N$14
  Top 0.203: U2.39 35.13,21.07 34.61,21.59 34.61,22.23 34.16,22.67 33.97,22.86 33.66,22.86 C20.2 33.53,22.86 30.48,22.86 29.84,23.5 Y1.2
N$15  (via drill 0.25)
  Top 0.254: R29.1 v60.33,62.23 R67.1 | v29.84,67.31 IC4.7
  Bottom 0.254: v60.33,62.23 48.9,62.23 47.62,60.96 46.35,60.96 44.77,62.55 31.11,62.55 30.48,63.18 30.48,66.67 v29.84,67.31
N$16
  Top 0.254: R66.2 LED5.A
N$17
  Top 0.203: U2.6 49.19,19.07 49.53,18.73 49.53,17.14 50.48,16.19 50.48,5.71 50.29,5.52 R48.1
N$18
  Top 0.203: U2.7 49.65,19.57 50.16,19.05 50.16,17.14 51.12,16.19 51.12,5.71 51.31,5.52 R48.2
N$21
  Top 0.254: R15.2 65.42,69.36 J15.TIP 68.74,67.78 72.39,64.14 72.39,60.96 73.04,60.31 R17.2
N$22
  Top 0.254: R23.2 78.75,69.36 J16.TIP 82.08,67.78 85.72,64.14 85.72,60.96 86.38,60.31 R51.2
N$23  (via drill 0.25)
  Top 0.254: R17.1 v73.66,62.23 R52.1 | v24.13,67.31 IC4.8
  Bottom 0.254: v73.66,62.23 72.39,60.96 48.9,60.96 48.26,60.33 45.72,60.33 44.13,61.91 29.21,61.91 28.26,62.87 28.26,64.45 25.4,67.31 v24.13,67.31
N$24
  Top 0.254: R67.2 LED6.A
N$28  (via drill 0.25)
  Top 0.203: R51.1 87.42,61.49 88.27,60.64 88.27,58.1 85.72,55.56 v75.56,55.56
  Top 0.254: R51.1 R53.1 | IC4.14 25.4,59.69 26.67,58.42 v31.11,58.42
  Bottom 0.254: v75.56,55.56 33.97,55.56 v31.11,58.42
N$29
  Top 0.254: LED7.A R52.2
N$30
  Top 0.254: R53.2 LED8.A
N$32
  Top 0.254: R19.2 38.75,69.36 J13.TIP 42.07,67.78 45.72,64.14 45.72,60.96 46.37,60.31 R21.2
N$33
  Top 0.254: R24.1 60.48,107.95 J17.TIP
N$34
  Top 0.254: R25.2 52.09,69.36 J14.TIP 55.41,67.78 59.05,64.14 59.05,60.96 59.7,60.31 R29.2
N$35
  Top 0.254: R27.1 13.81,94.61 J2.TIP
N$36
  Top 0.254: R30.1 20.48,107.95 J3.TIP
N$37
  Top 0.254: R34.1 27.15,94.61 J4.TIP
N$38
  Top 0.254: R32.1 7.14,107.95 J1.TIP
N$39
  Top 0.254: R36.1 33.81,107.95 J5.TIP
N$40
  Top 0.254: R56.1 40.48,94.61 J6.TIP
N$43
  Top 0.254: R58.1 47.15,107.95 J7.TIP
N$44
  Top 0.254: R60.1 53.82,94.61 J8.TIP
N$67
  Top 0.254: R6.2 LED1.A
N$68
  Top 0.254: R7.2 LED2.A
N$70
  Top 0.254: LED3.A R9.2
N$71
  Top 0.254: R11.2 LED4.A
N$109
  Top 0.203: U2.40 35.17,20.57 34.61,20 34.61,18.41 34.16,17.97 33.97,17.78 33.66,17.78 C19.2 33.53,17.78 30.16,17.78 29.97,17.65 29.84,17.78 Y1.1
NMI  (via drill 0.25)
  Top 0.203: POP.2 28.8,5.44 R4.1 C31.1 30.48,5.71 33.02,8.26 v33.02,12.7 | U2.33 35.78,24.07 v35.24,24.61
  Top 0.406: POP.1 POP.2
  Bottom 0.203: v33.02,12.7 34.61,14.29 34.61,16.19 35.24,16.83 v35.24,24.61
OLED-DC  (via drill 0.25)
  Top 0.203: U2.26 41.8,24.88 43.34,23.34 45.56,23.34 48.26,26.04 49.85,26.04 50.8,26.99 50.8,43.5 v56.83,49.53
  Bottom 0.203: U$1.4 60.94,53.63 v56.83,49.53
OLED-RES  (via drill 0.25)
  Top 0.203: U2.25 42.3,25.02 43.5,23.81 45.4,23.81 48.26,26.67 49.53,26.67 50.16,27.3 50.16,31.75 48.26,33.66 v46.35,33.66 | v25.4,48.58 25.4,48.55 U$1.16
  Bottom 0.203: v46.35,33.66 45.72,34.29 34.29,34.29 25.4,43.18 v25.4,48.58
RESET  (via drill 0.25)
  Top 0.203: U2.63 45.8,13.58 46.04,13.34 v46.04,13.02 | v21.91,16.51 12.51,16.51 R40.1
  Top 0.254: R40.1 C41.1 9.4,16.64 v8.89,17.14
  Bottom 0.203: v46.04,13.02 46.04,10.48 42.55,6.99 30.16,6.99 26.99,10.16 26.99,11.43 v21.91,16.51
  Bottom 0.406: v8.89,17.14 7.31,17.14 SW40.2
RG1
  Top 0.254: IC1.6 23.91,78.74 R38.1 24.11,78.71 R12.2
RG2
  Top 0.254: IC1.2 23.91,73.66 R37.1 24.11,73.69 R13.2
RG3
  Top 0.254: R22.2 13.98,73.69 R46.1 13.98,73.66 IC1.13
RG4
  Top 0.254: IC1.9 14.19,78.74 R47.1 13.97,77.48 R28.2
RG5
  Top 0.254: IC4.2 30.48,60.96 | 30.48,60.96 32.38,60.96 33.66,62.23 33.66,64.45 36.2,66.99 36.2,68.8 R19.1 | R31.2 30.46,60.98 30.48,60.96
RG6  (via drill 0.25)
  Top 0.254: v49.85,69.85 R25.1 | v33.34,67.63 31.75,66.04 30.48,66.04 | 30.48,66.04 IC4.6 | R33.2 30.46,66.03 30.48,66.04
  Bottom 0.254: v49.85,69.85 46.35,66.36 34.61,66.36 v33.34,67.63
RG7  (via drill 0.25)
  Top 0.254: v63.18,69.85 R15.1 | v31.43,68.26 26.35,68.26 24.13,66.04 IC4.9 20.95,66.04 20.32,65.41 20.32,64.78 R35.2
  Bottom 0.254: v63.18,69.85 59.05,65.72 33.97,65.72 v31.43,68.26
RG8  (via drill 0.25)
  Top 0.254: v76.52,69.85 R23.1 | IC4.13 v20.32,60.96 20.32,62.22 R39.2
  Bottom 0.254: v76.52,69.85 71.75,65.09 33.34,65.09 29.84,68.58 24.13,68.58 20.32,64.77 v20.32,60.96
RX  (via drill 0.25)
  Top 0.203: U2.59 43.8,17.12 v44.13,17.46
  Bottom 0.203: J40.4 v11.75,26.67 13.34,26.67 29.84,10.16 29.84,9.53 31.11,8.26 41.27,8.26 43.34,10.32 43.34,13.49 44.13,14.29 v44.13,17.46
SCK  (via drill 0.25)
  Top 0.203: U2.35 35.67,23.07 33.34,25.4 33.34,33.66 v37.47,37.78 | U4.12 42.22,41.59 40.32,39.69 v39.05,39.69 | U3.12 31.43,40.33 v32.07,39.69 | U7.1 72.02,49.27 69.22,52.07 54.91,52.07 U$1.7
  Bottom 0.203: 37.47,39.69 v39.05,39.69 40.64,38.1 46.35,38.1 53.34,45.09 U$1.7 | 37.47,39.69 v32.07,39.69 | v37.47,37.78 37.47,39.69
SCL  (via drill 0.25)
  Top 0.203: U2.28 40.8,23.97 40.64,23.81 40.64,20.32 39.37,19.05 39.37,18.41 v38.42,17.46 | R16.1 v17.14,28.57
  Bottom 0.203: v38.42,17.46 37.15,16.19 37.15,14.61 33.66,11.11 29.84,11.11 17.14,23.81 v17.14,28.57 17.14,33.02 13.34,36.83 2.54,36.83 1.91,37.47 1.91,39.37
  Bottom 0.254: 1.91,39.37 JP2.3 JP2.4 JP1.3 JP1.4
SDA  (via drill 0.25)
  Top 0.203: U2.29 40.3,24.42 40.01,24.13 40.01,20.32 v38.42,18.73 | R5.1 v18.41,26.67
  Bottom 0.203: v38.42,18.73 36.51,16.83 36.51,14.92 33.34,11.75 30.16,11.75 18.41,23.5 v18.41,26.67 18.41,33.02 14.61,36.83
  Bottom 0.254: 14.61,36.83 14.61,37.47 JP1.2 JP1.1 JP2.2 JP2.1
TX  (via drill 0.25)
  Top 0.203: U2.47 34.85,17.07 33.02,15.24 33.02,13.97 31.11,12.06 28.57,12.06 16.51,24.13 v11.75,24.13
  Bottom 0.203: J40.5 v11.75,24.13
USB-OC  (via drill 0.25, 0.5)
  Top 0.203: U2.60 44.3,16.36 45.09,17.14 46.04,17.14 48.26,14.92 v48.26,14.29
  Top 0.254: U1.5 17.14,14.61 v17.78,13.97 | R2.1 24.13,12.06 v25.72,10.48
  Bottom 0.203: v48.26,14.29 48.26,11.75 43.18,6.35 29.84,6.35 v25.72,10.48
  Bottom 0.254: v25.72,10.48 22.23,13.97 v17.78,13.97
USB-VBOF  (via drill 0.25)
  Top 0.203: U2.62 45.3,15.77 v45.72,16.19 | R1.1 24.45,13.97 v28.26,10.16
  Top 0.254: U1.4 21.27,14.61 21.91,15.24 22.99,15.24 R1.1
  Bottom 0.203: v45.72,16.19 45.72,13.97 45.09,13.34 45.09,10.79 41.91,7.62 30.8,7.62 v28.26,10.16
VBUS  (via drill 0.25, 0.38, 0.5)
  Top 0.203: U2.52 40.3,16.16 v40.64,16.51 | v31.43,9.21 25.08,9.21 v24.13,10.16
  Top 0.254: U1.6 17.14,13.34 v17.78,12.7
  Top 0.406: C5.+ 12.83,10.79 | C7.2 12.7,8.26 12.7,7.62
  Top 0.61: U1.6 U1.7 U1.8 12.83,10.79 | C5.+ 12.7,7.62 12.7,6.35 10.79,4.45 8.56,4.45 USB.1
  Bottom 0.203: v40.64,16.51 41.27,15.88 41.27,12.7 37.78,9.21 v31.43,9.21 | v24.13,10.16 21.59,12.7 v17.78,12.7
VDDIN  (via drill 0.25)
  Top 0.203: C12.2 v44.45,27.94 44.3,27.79 U2.21 | C51.2 C12.2 | C50.2 C12.2 | R42.1 v53.34,31.75
  PWR 0.406: v53.34,31.75 50.16,28.57 45.09,28.57 v44.45,27.94
VDDIO  (via drill 0.25)
  Top 0.203: 36.26,16.57 v35.56,15.88 36.2,15.24 C17.2 C18.2 | C10.2 C49.2 | C47.2 C10.2 | U2.32 38.8,27.25 v38.1,27.94 C16.2 C56.2 | R41.1 v51.75,31.75 | U2.64 46.3,14.03 v47.31,13.02 C10.2
  Top 0.254: U2.48 36.26,16.57
  PWR 0.406: v51.75,31.75 49.85,29.84 40.01,29.84 v38.1,27.94
  pour PWR: 38.1,27.94 35.56,25.4 35.56,12.06 37.47,10.16 44.45,10.16 46.99,12.7 46.99,13.34 46.67,13.65 45.72,13.65 44.13,12.06 40.01,12.06 39.37,12.7 39.37,27.94
VDDOUT  (via drill 0.25)
  Top 0.203: U2.56 42.3,13.27 v42.55,13.02 C14.2 C52.2 | U2.8 49.6,20.07 v49.85,20.32 50.48,20.95 C8.2 C45.2 C46.2 | C55.2 C54.2 | C15.2 C54.2 | U2.53 40.8,13.49 v40.32,13.02 40.32,12.83 39.37,11.87 C54.2 | 39.37,11.43 C54.2 | C48.2 C11.2 47.62,28.89 46.67,27.94 45.72,27.94 44.8,27.02 U2.20 44.8,24.95 v44.45,24.61 43.8,25.26 U2.22 43.8,27.32 43.18,27.94 42.42,27.94 41.27,29.08 C13.2 C53.2
  Top 0.406: C9.2 C8.2
  pour PWR: 40.32,12.7 40.01,13.02 40.01,27.94 46.99,27.94 50.16,24.77 50.16,19.05 43.81,12.7
VREF
  Top 0.203: U3.1 34.02,48.95 35.88,50.8 65.41,50.8 70.84,45.37 U7.7

### Text on the board
Bottom: monome.org / teletype180824
tPlace: gnd | scl | sda | 12864UCY3 - OPEN / 12864WDY3 - CLOSE
bPlace: gnd | scl | sda | gnd | rx | tx
bNames: -12v
bDocu: mosi | sck | miso | 12v | 3v3 | -12v | 5v | GND
_tPlace: PARAM
_bPlace: J40